# EAGLE design full_commissioning_shield (EAGLE 7.3.0)

## Sheet 1 of 11: arduino footprint
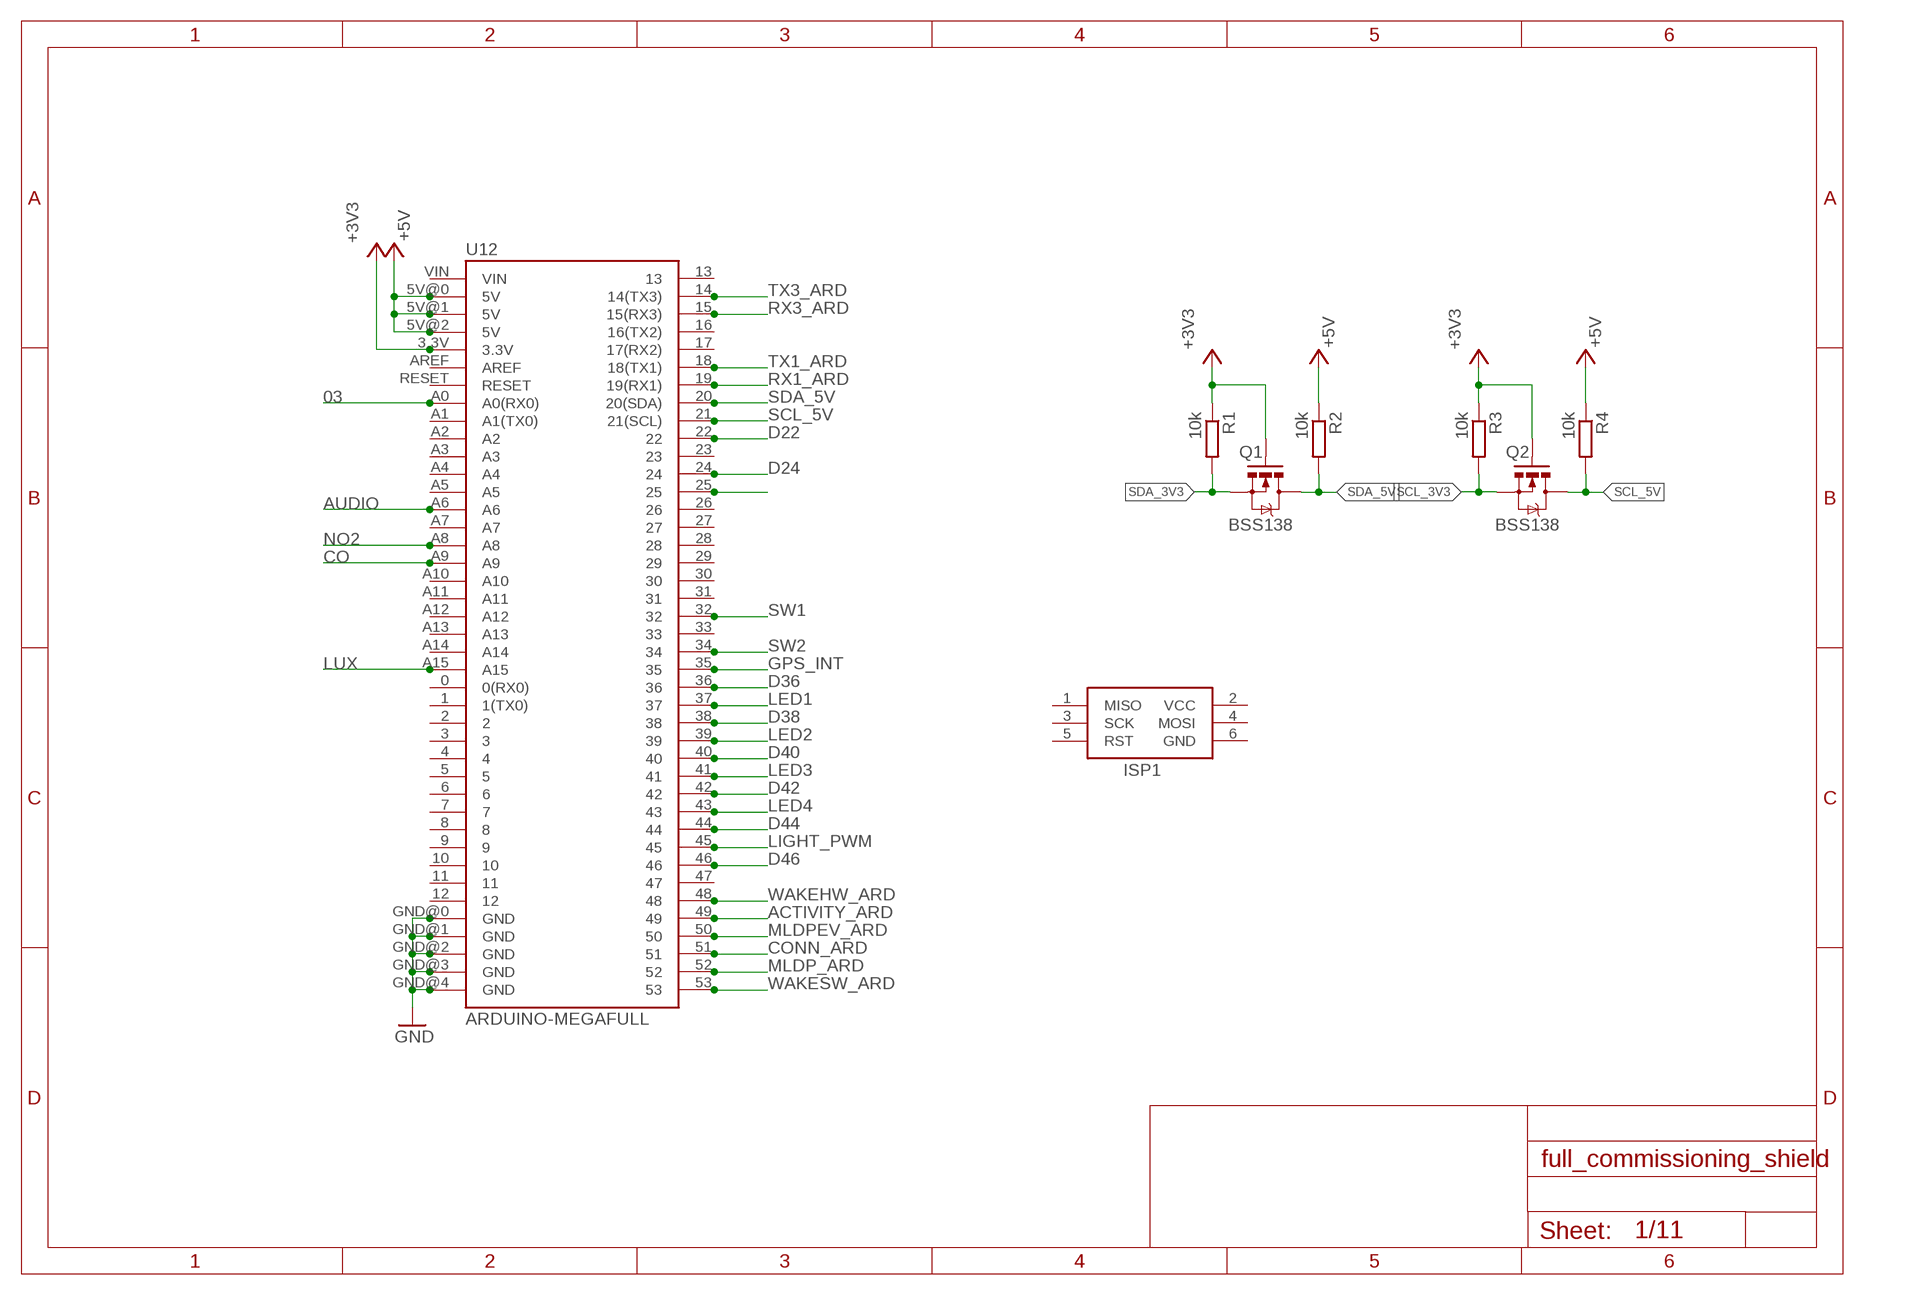
[diagram p0: schematic, sheet 1]

### Parts
ISP1  AVRISP-6  [AVRISP]
Q1  BSS138  MOSFET-NCHANNELSMD  [SOT23-3]
Q2  BSS138  MOSFET-NCHANNELSMD  [SOT23-3]
R1  10k  R-EU_R0805  [R0805]
R2  10k  R-EU_R0805  [R0805]
R3  10k  R-EU_R0805  [R0805]
R4  10k  R-EU_R0805  [R0805]
U12  ARDUINO-MEGAFULL  [ARDUINO_MEGA]

### Nets
03: U12.A0(A0(RX0)) ; also sheet 6
+3V3: Q1.1(G) Q2.1(G) R1.1 R3.1 U12.3.3V ; also sheet 3,4,6,7,10,11
+5V: R2.1 R4.1 U12.5V@0(5V) U12.5V@1(5V) U12.5V@2(5V) ; also sheet 2,3,6,9,10
ACTIVITY_ARD: U12.49 ; also sheet 3
AUDIO: U12.A6 ; also sheet 10
CO: U12.A9 ; also sheet 6
CONN_ARD: U12.51 ; also sheet 3
D22: U12.22
D24: U12.24
D36: U12.36 ; also sheet 5
D38: U12.38 ; also sheet 5
D40: U12.40 ; also sheet 5
D42: U12.42 ; also sheet 5
D44: U12.44 ; also sheet 5
D46: U12.46 ; also sheet 5
GND: U12.GND@0(GND) U12.GND@1(GND) U12.GND@2(GND) U12.GND@3(GND) U12.GND@4(GND) ; also sheet 2,3,4,5,6,7,8,9,10,11
GPS_INT: U12.35 ; also sheet 11
LED1: U12.37 ; also sheet 5
LED2: U12.39 ; also sheet 5
LED3: U12.41 ; also sheet 5
LED4: U12.43 ; also sheet 5
LIGHT_PWM: U12.45 ; also sheet 8
LUX: U12.A15 ; also sheet 6
MLDP_ARD: U12.52 ; also sheet 3
MLDPEV_ARD: U12.50 ; also sheet 3
N$33: U12.25
NO2: U12.A8 ; also sheet 6
RX1_ARD: U12.19(19(RX1))
RX3_ARD: U12.15(15(RX3)) ; also sheet 3
SCL_3V3: Q2.2(S) R3.2 ; also sheet 4,6,7,11
SCL_5V: Q2.3(D) R4.2 U12.21(21(SCL)) ; also sheet 9
SDA_3V3: Q1.2(S) R1.2 ; also sheet 4,6,7,11
SDA_5V: Q1.3(D) R2.2 U12.20(20(SDA)) ; also sheet 9
SW1: U12.32 ; also sheet 5
SW2: U12.34 ; also sheet 5
TX1_ARD: U12.18(18(TX1))
TX3_ARD: U12.14(14(TX3)) ; also sheet 3
WAKEHW_ARD: U12.48 ; also sheet 3
WAKESW_ARD: U12.53 ; also sheet 3
Unconnected: ISP1.1(MISO) ISP1.3(SCK) ISP1.4(MOSI) ISP1.5(RST) U12.0(0(RX0)) U12.1(1(TX0)) U12.2 U12.3 U12.4 U12.5 U12.6 U12.7 U12.8 U12.9 U12.10 U12.11 U12.12 U12.13 U12.16(16(TX2)) U12.17(17(RX2)) U12.23 U12.26 U12.27 U12.28 U12.29 U12.30 U12.31 U12.33 U12.47 U12.A1(A1(TX0)) U12.A2 U12.A3 U12.A4 U12.A5 U12.A7 U12.A10 U12.A11 U12.A12 U12.A13 U12.A14 U12.AREF U12.RESET U12.VIN

## Sheet 2 of 11: Power supply
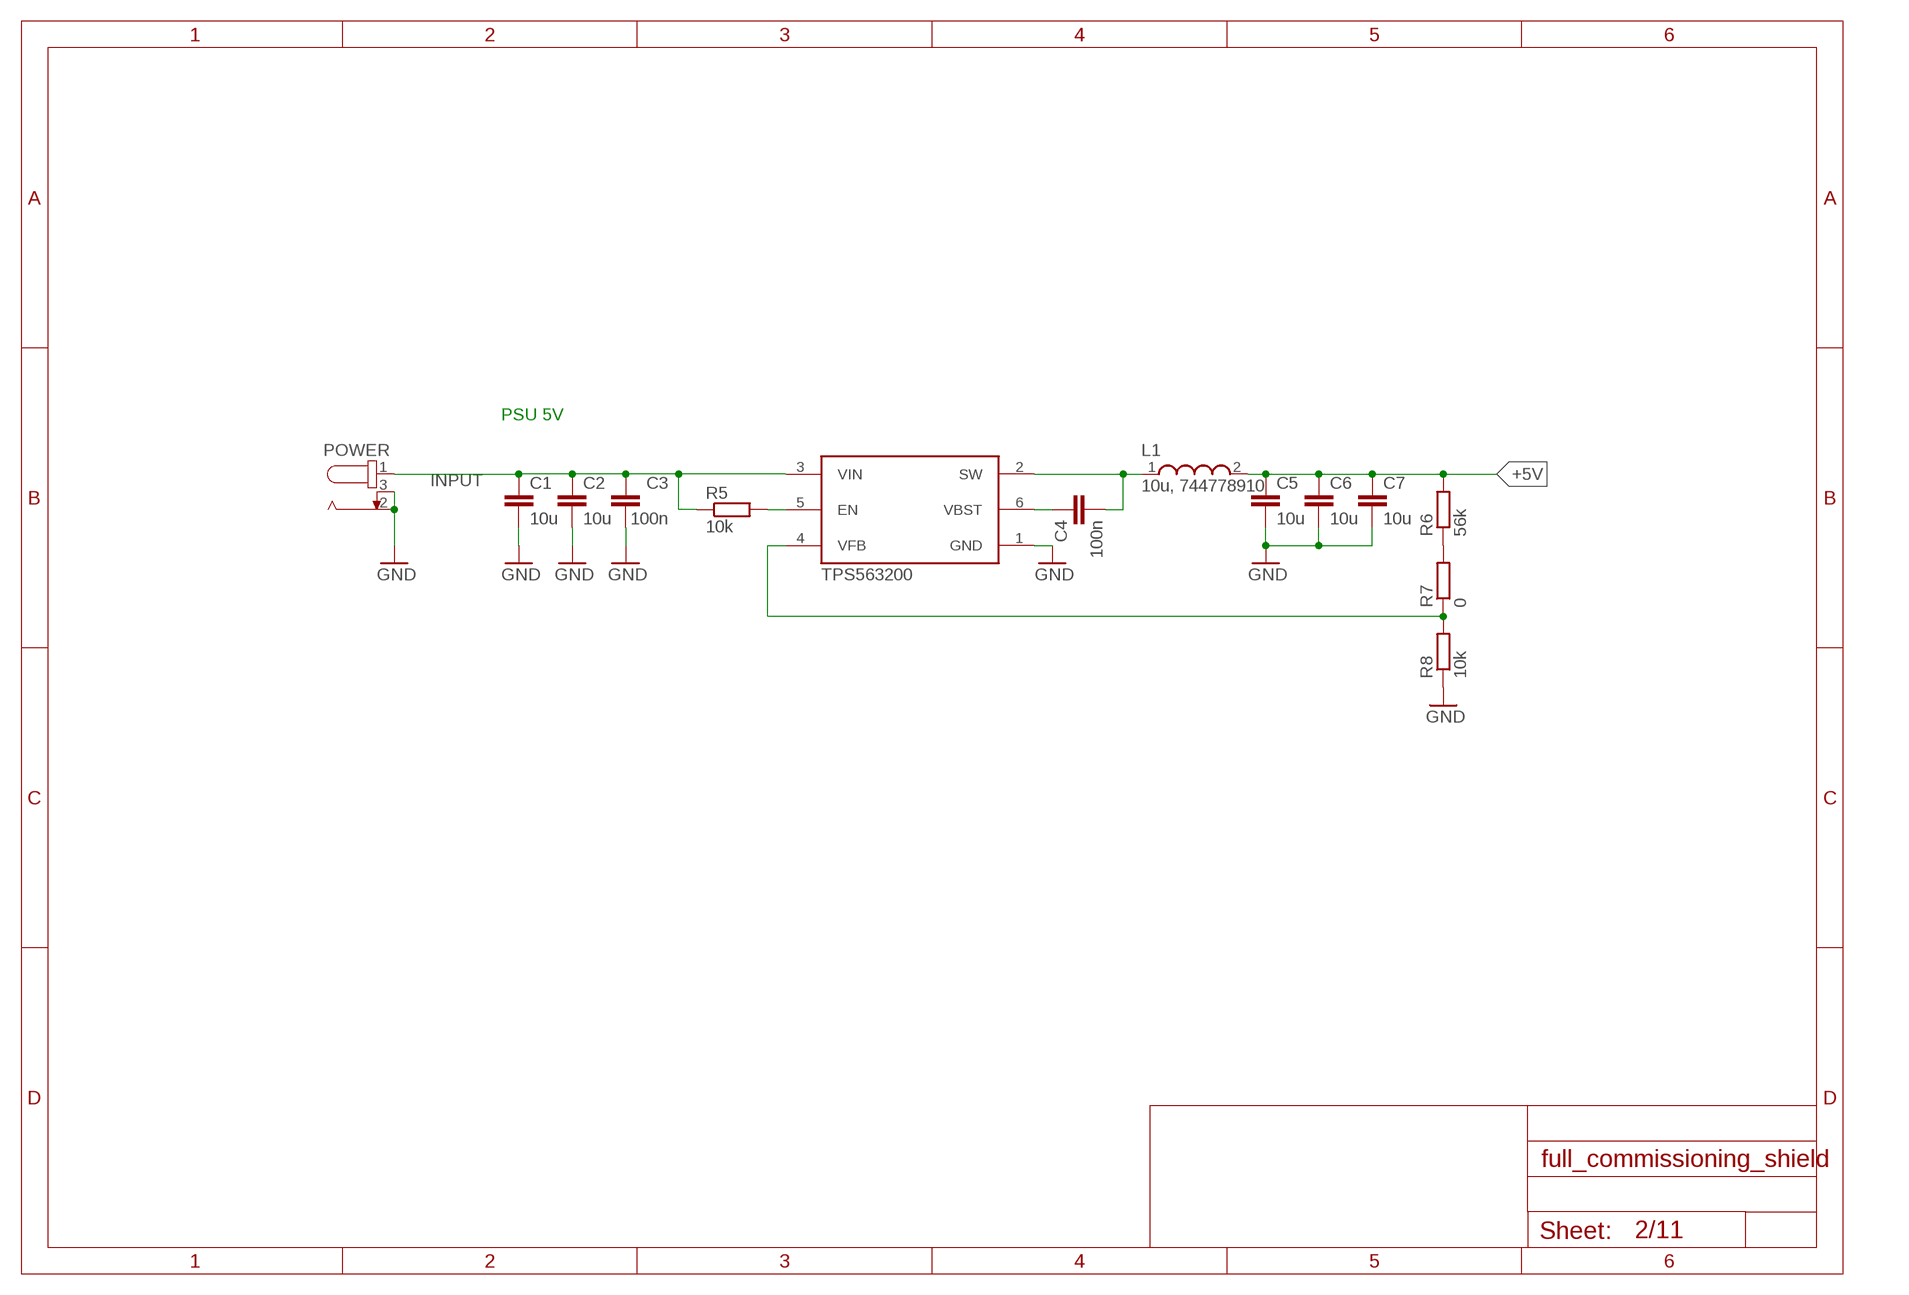
[diagram p1: schematic, sheet 2]

### Parts
C1  10u  C-EUC1206  [C1206]
C2  10u  C-EUC1206  [C1206]
C3  100n  C-EUC0805  [C0805]
C4  100n  C-EUC0805  [C0805]
C5  10u  C-EUC1206  [C1206]
C6  10u  C-EUC1206  [C1206]
C7  10u  C-EUC1206  [C1206]
L1  10u, 744778910  WE-PD_7332/7345  [WE-PD_7332/7345]
POWER  694108301002  [69410X301002]
R5  10k  R-EU_R0805  [R0805]
R6  56k  R-EU_R0805  [R0805]
R7  0  R-EU_R0805  [R0805]
R8  10k  R-EU_R0805  [R0805]
U13  TPS563200  [SOT95P280X145-6N]

### Nets
+5V: C5.1 C6.1 C7.1 L1.2 R6.2 ; also sheet 1,3,6,9,10
GND: C1.2 C2.2 C3.1 C5.2 C6.2 C7.2 POWER.2 POWER.3 R8.1 U13.1(GND) ; also sheet 1,3,4,5,6,7,8,9,10,11
INPUT: C1.1 C2.1 C3.2 POWER.1 R5.1 U13.3(VIN) ; also sheet 8
N$3: R5.2 U13.5(EN)
N$4: C4.1 U13.6(VBST)
N$5: R6.1 R7.2
N$6: R7.1 R8.2 U13.4(VFB)
SW: C4.2 L1.1 U13.2(SW)

### Notes on the sheet
- PSU 5V
- TPS563200

## Sheet 3 of 11: BLE
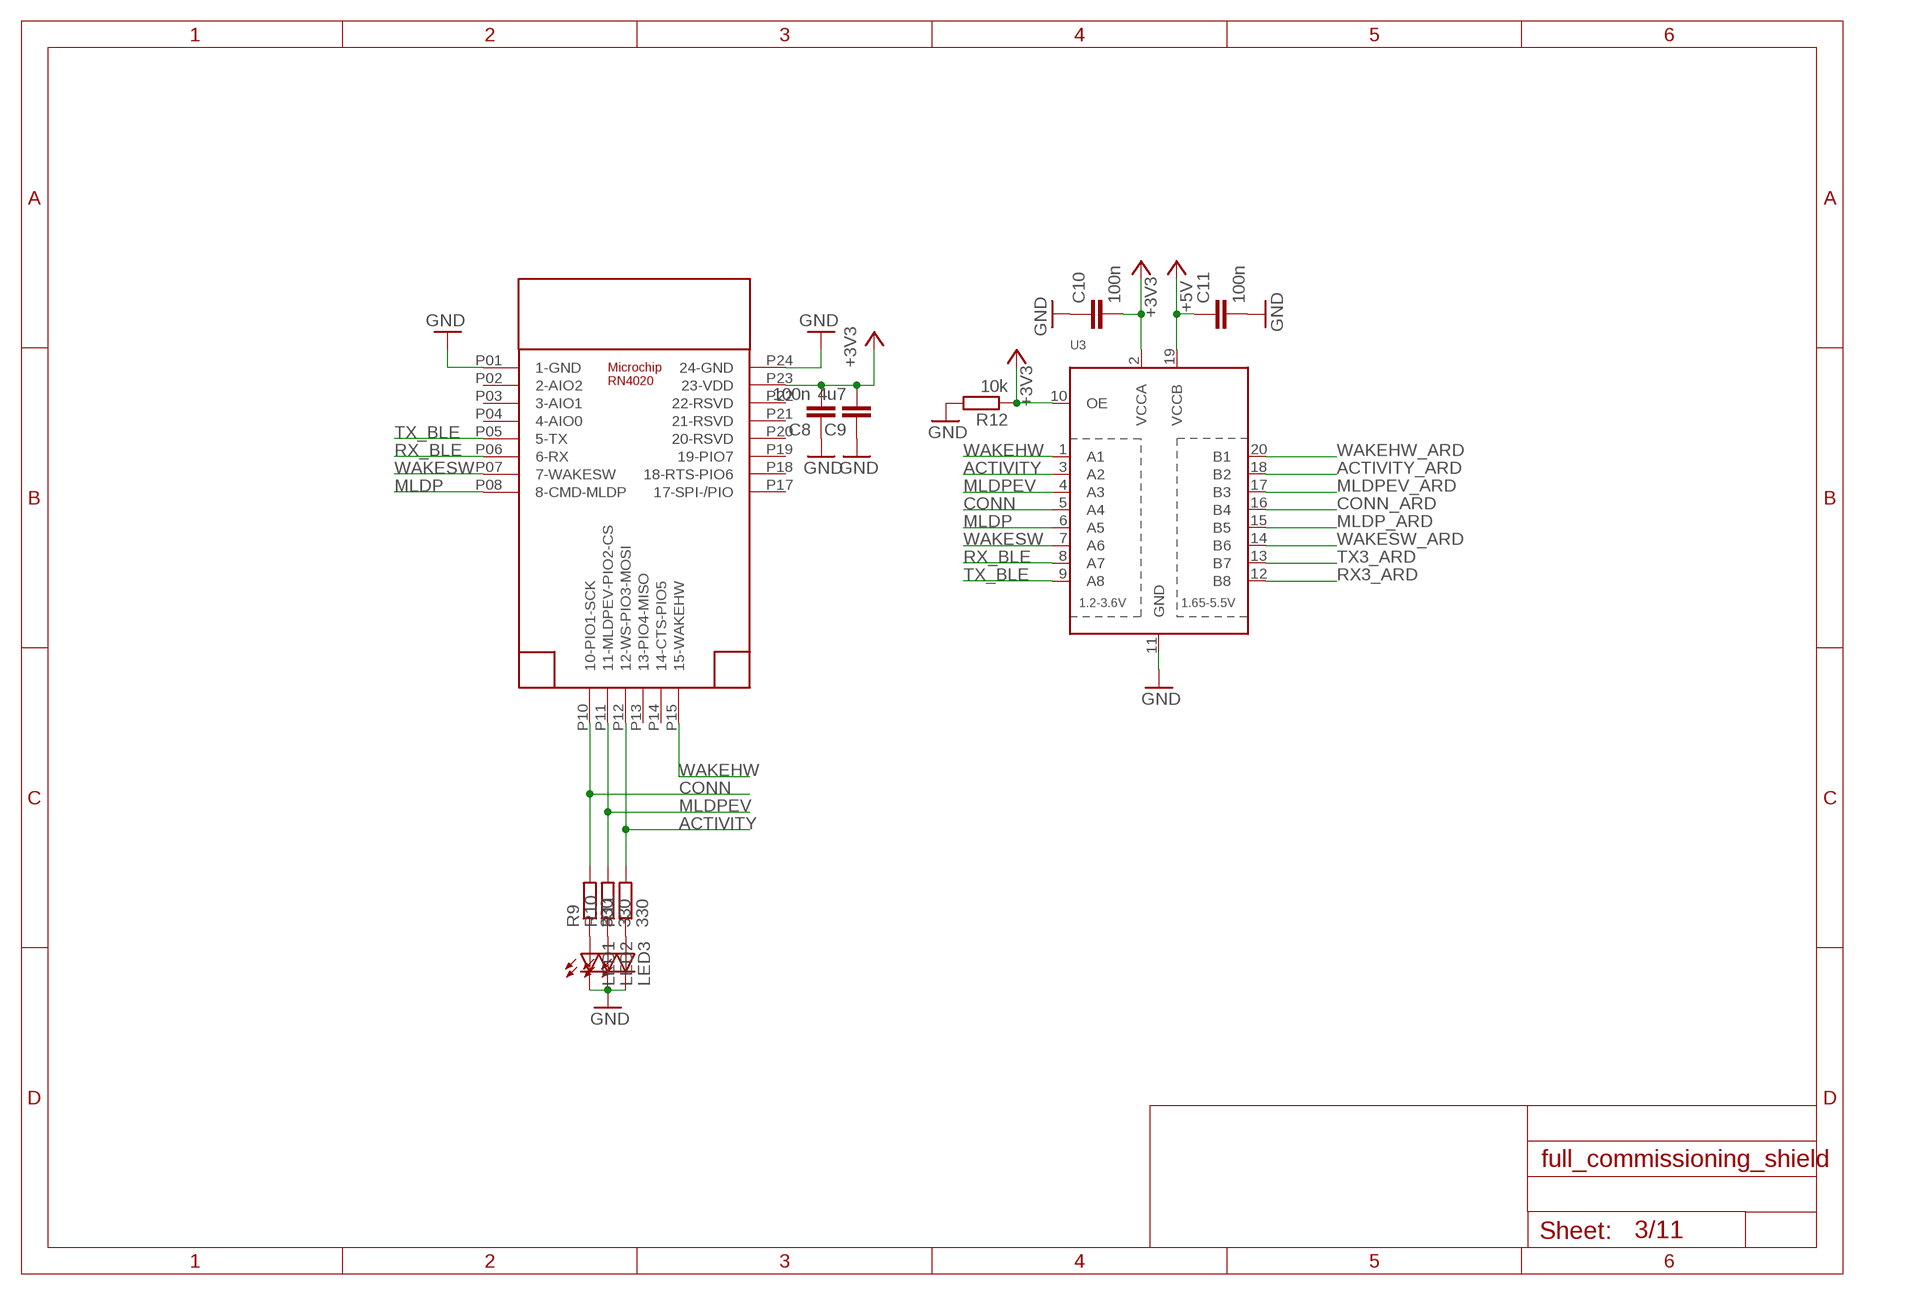
[diagram p2: schematic, sheet 3]

### Parts
C8  100n  C-EUC0805K  [C0805K]
C9  4u7  C-EUC0805K  [C0805K]
C10  100n  C-EUC0805  [C0805]
C11  100n  C-EUC0805  [C0805]
LED1  LEDCHIP-LED0805  [CHIP-LED0805]
LED2  LEDCHIP-LED0805  [CHIP-LED0805]
LED3  LEDCHIP-LED0805  [CHIP-LED0805]
R9  330  R-EU_R0805  [R0805]
R10  330  R-EU_R0805  [R0805]
R11  330  R-EU_R0805  [R0805]
R12  10k  R-EU_R0805  [R0805]
U2  RN4020  [RN4020SMD]
U3  TXB0108PWR  [TSSOP20]

### Nets
+3V3: C8.2 C9.2 C10.2 R12.1 U2.P23(23-VDD) U3.2(VCCA) U3.10(OE) ; also sheet 1,4,6,7,10,11
+5V: C11.1 U3.19(VCCB) ; also sheet 1,2,6,9,10
ACTIVITY: R11.2 U2.P12(12-WS-PIO3-MOSI) U3.3(A2)
ACTIVITY_ARD: U3.18(B2) ; also sheet 1
CONN: R9.2 U2.P10(10-PIO1-SCK) U3.5(A4)
CONN_ARD: U3.16(B4) ; also sheet 1
GND: C8.1 C9.1 C10.1 C11.2 LED1.C LED2.C LED3.C R12.2 U2.P01(1-GND) U2.P24(24-GND) U3.11(GND) ; also sheet 1,2,4,5,6,7,8,9,10,11
MLDP: U2.P08(8-CMD-MLDP) U3.6(A5)
MLDP_ARD: U3.15(B5) ; also sheet 1
MLDPEV: R10.2 U2.P11(11-MLDPEV-PIO2-CS) U3.4(A3)
MLDPEV_ARD: U3.17(B3) ; also sheet 1
N$16: LED1.A R9.1
N$17: LED2.A R10.1
N$18: LED3.A R11.1
RX3_ARD: U3.12(B8) ; also sheet 1
RX_BLE: U2.P06(6-RX) U3.8(A7)
TX3_ARD: U3.13(B7) ; also sheet 1
TX_BLE: U2.P05(5-TX) U3.9(A8)
WAKEHW: U2.P15(15-WAKEHW) U3.1(A1)
WAKEHW_ARD: U3.20(B1) ; also sheet 1
WAKESW: U2.P07(7-WAKESW) U3.7(A6)
WAKESW_ARD: U3.14(B6) ; also sheet 1
Unconnected: U2.P02(2-AIO2) U2.P03(3-AIO1) U2.P04(4-AIO0) U2.P13(13-PIO4-MISO) U2.P14(14-CTS-PIO5) U2.P17(17-SPI-/PIO) U2.P18(18-RTS-PIO6) U2.P19(19-PIO7) U2.P20(20-RSVD) U2.P21(21-RSVD) U2.P22(22-RSVD)

## Sheet 4 of 11: NFC
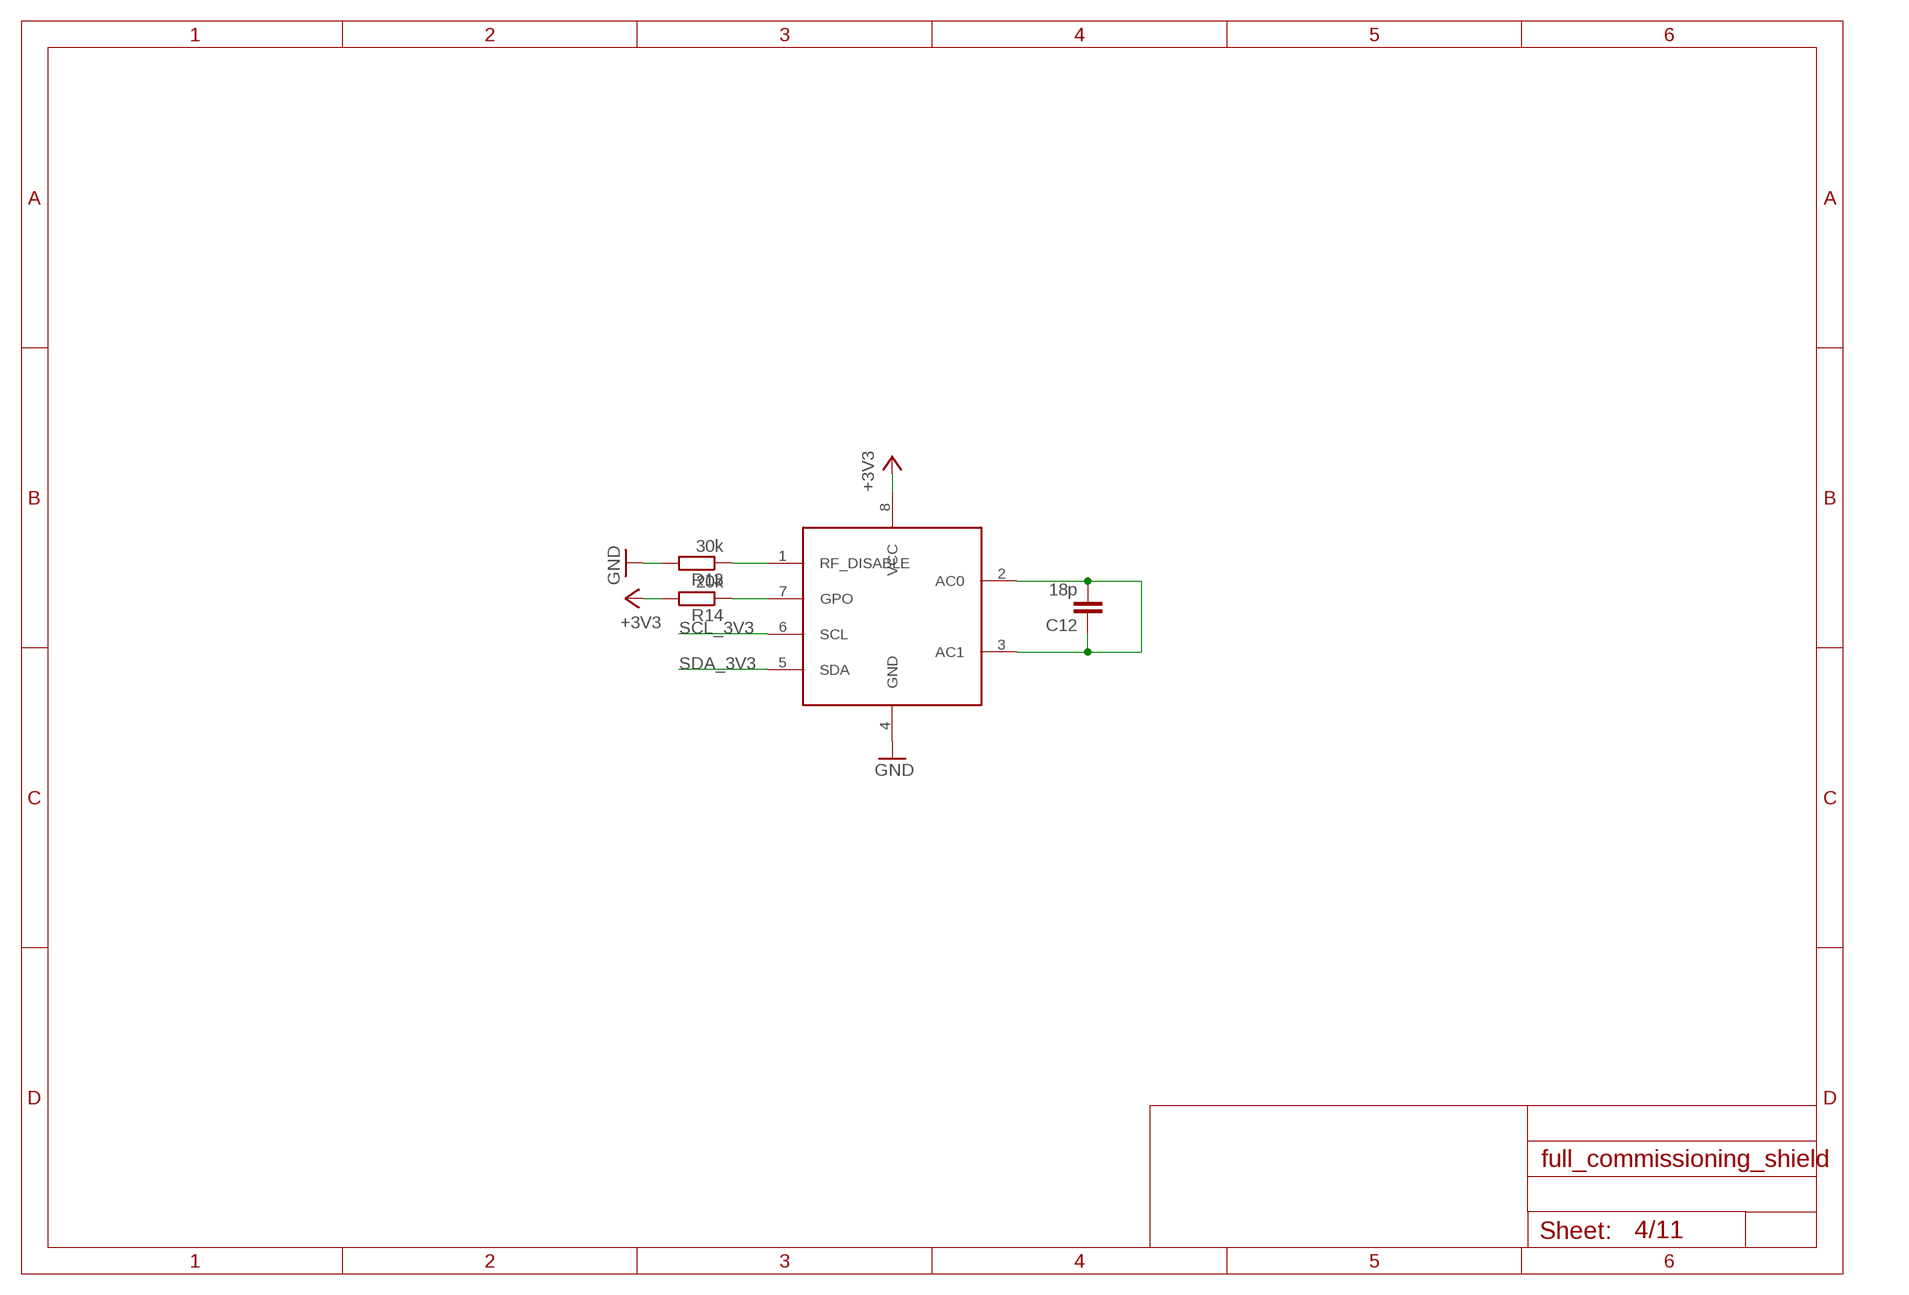
[diagram p3: schematic, sheet 4]

### Parts
C12  18p  C-EUC0805K  [C0805K]
NFC  M24SR  [SO8]
R13  30k  R-EU_R0805  [R0805]
R14  20k  R-EU_R0805  [R0805]

### Nets
+3V3: NFC.8(VCC) R14.2 ; also sheet 1,3,6,7,10,11
GND: NFC.4(GND) R13.2 ; also sheet 1,2,3,5,6,7,8,9,10,11
N$9: C12.1 C12.2 NFC.2(AC0) NFC.3(AC1)
N$11: NFC.1(RF_DISABLE) R13.1
N$12: NFC.7(GPO) R14.1
SCL_3V3: NFC.6(SCL) ; also sheet 1,6,7,11
SDA_3V3: NFC.5(SDA) ; also sheet 1,6,7,11

## Sheet 5 of 11: Leds & switches
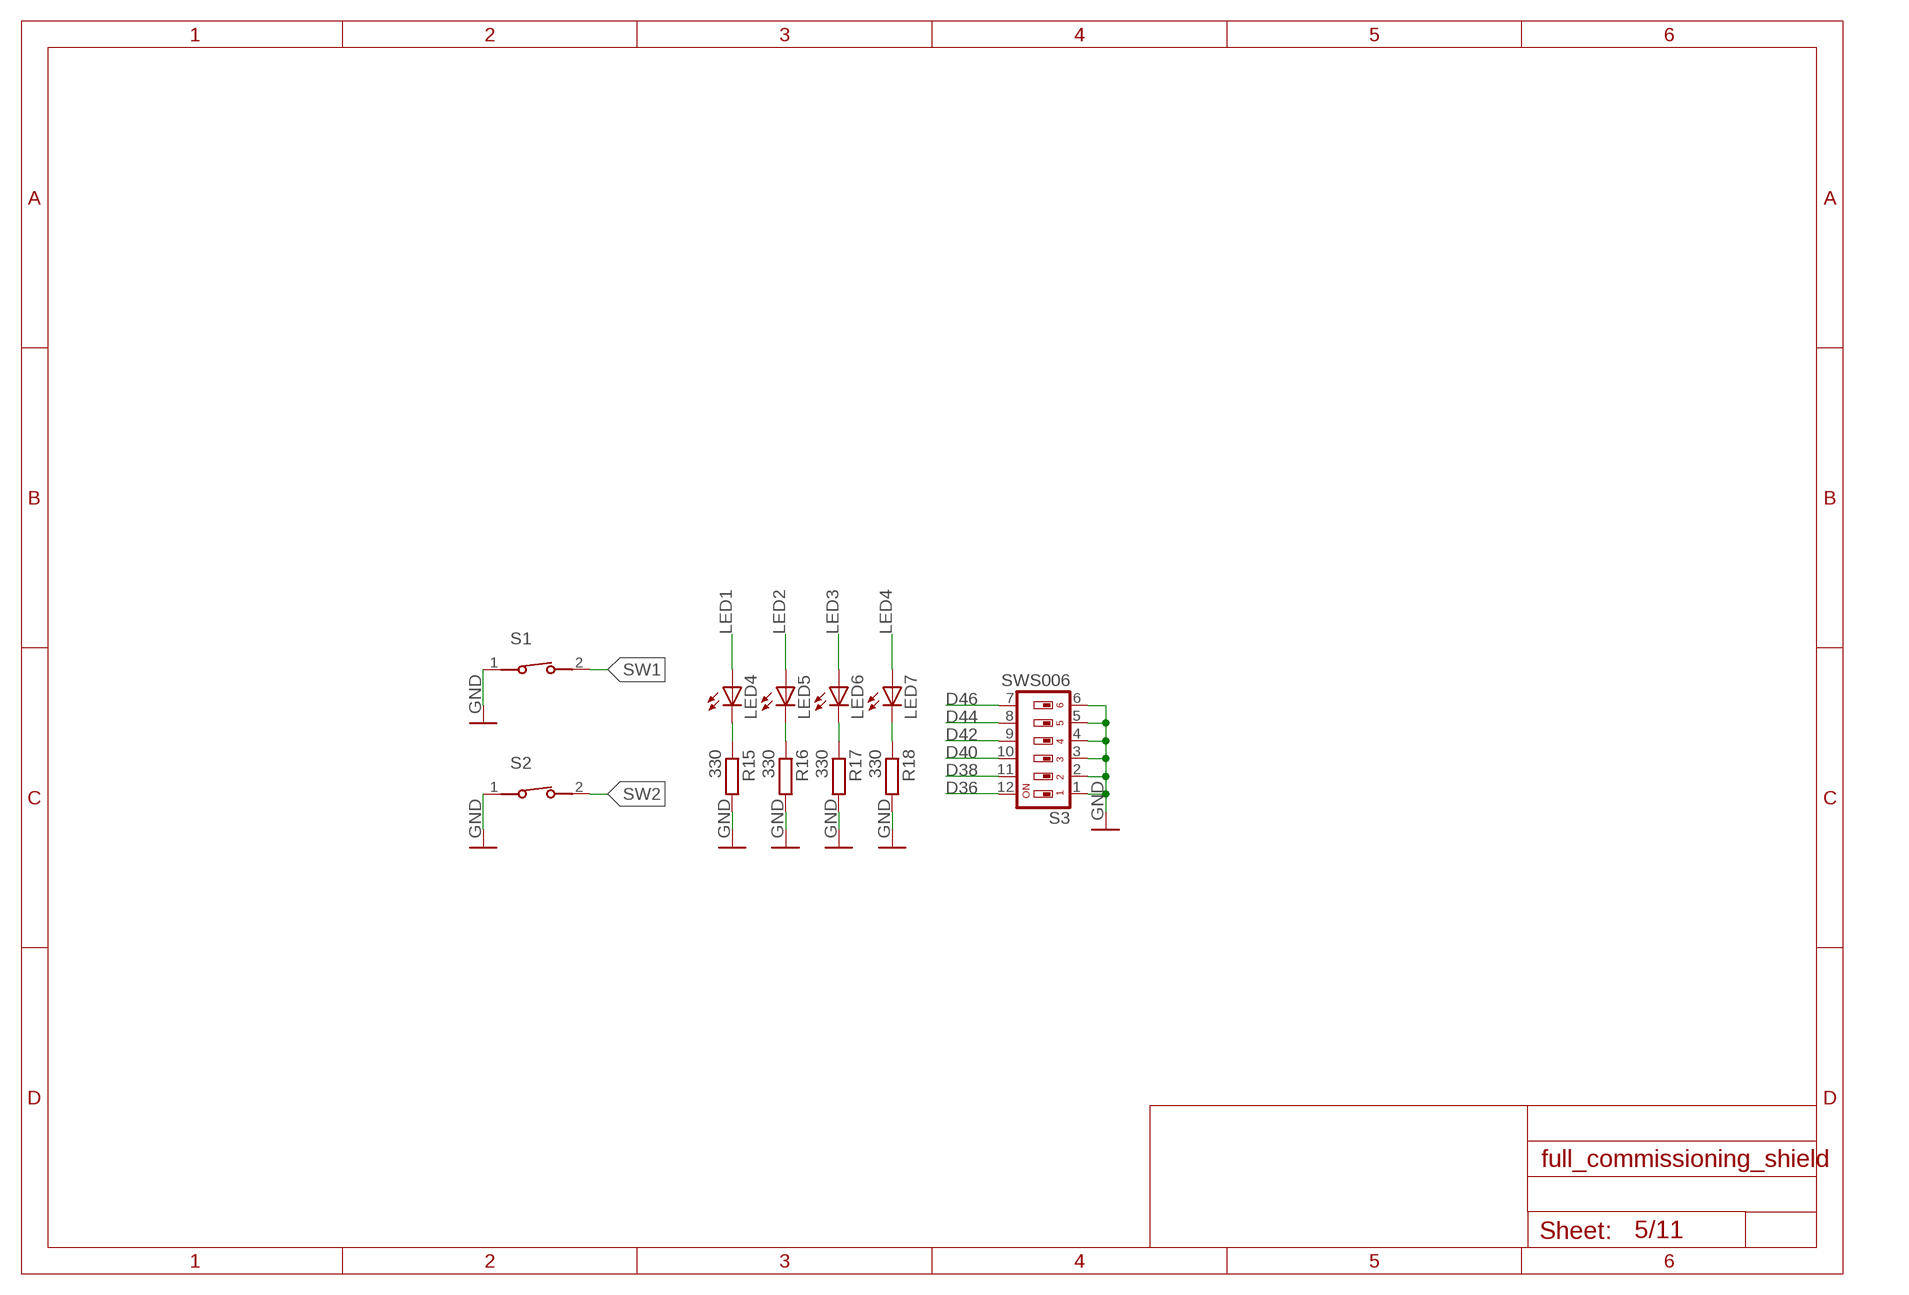
[diagram p4: schematic, sheet 5]

### Parts
LED4  LEDCHIP-LED0805  [CHIP-LED0805]
LED5  LEDCHIP-LED0805  [CHIP-LED0805]
LED6  LEDCHIP-LED0805  [CHIP-LED0805]
LED7  LEDCHIP-LED0805  [CHIP-LED0805]
R15  330  R-EU_R0805  [R0805]
R16  330  R-EU_R0805  [R0805]
R17  330  R-EU_R0805  [R0805]
R18  330  R-EU_R0805  [R0805]
S1  434111043826  [434111043826]
S2  434111043826  [434111043826]
S3  SWS006  [SMS-006]

### Nets
D36: S3.12 ; also sheet 1
D38: S3.11 ; also sheet 1
D40: S3.10 ; also sheet 1
D42: S3.9 ; also sheet 1
D44: S3.8 ; also sheet 1
D46: S3.7 ; also sheet 1
GND: R15.2 R16.2 R17.2 R18.2 S1.1 S2.1 S3.1 S3.2 S3.3 S3.4 S3.5 S3.6 ; also sheet 1,2,3,4,6,7,8,9,10,11
LED1: LED4.A ; also sheet 1
LED2: LED5.A ; also sheet 1
LED3: LED6.A ; also sheet 1
LED4: LED7.A ; also sheet 1
N$1: LED5.C R16.1
N$2: LED4.C R15.1
N$8: LED6.C R17.1
N$21: LED7.C R18.1
SW1: S1.2 ; also sheet 1
SW2: S2.2 ; also sheet 1

## Sheet 6 of 11: Sensors gas + lux + temp
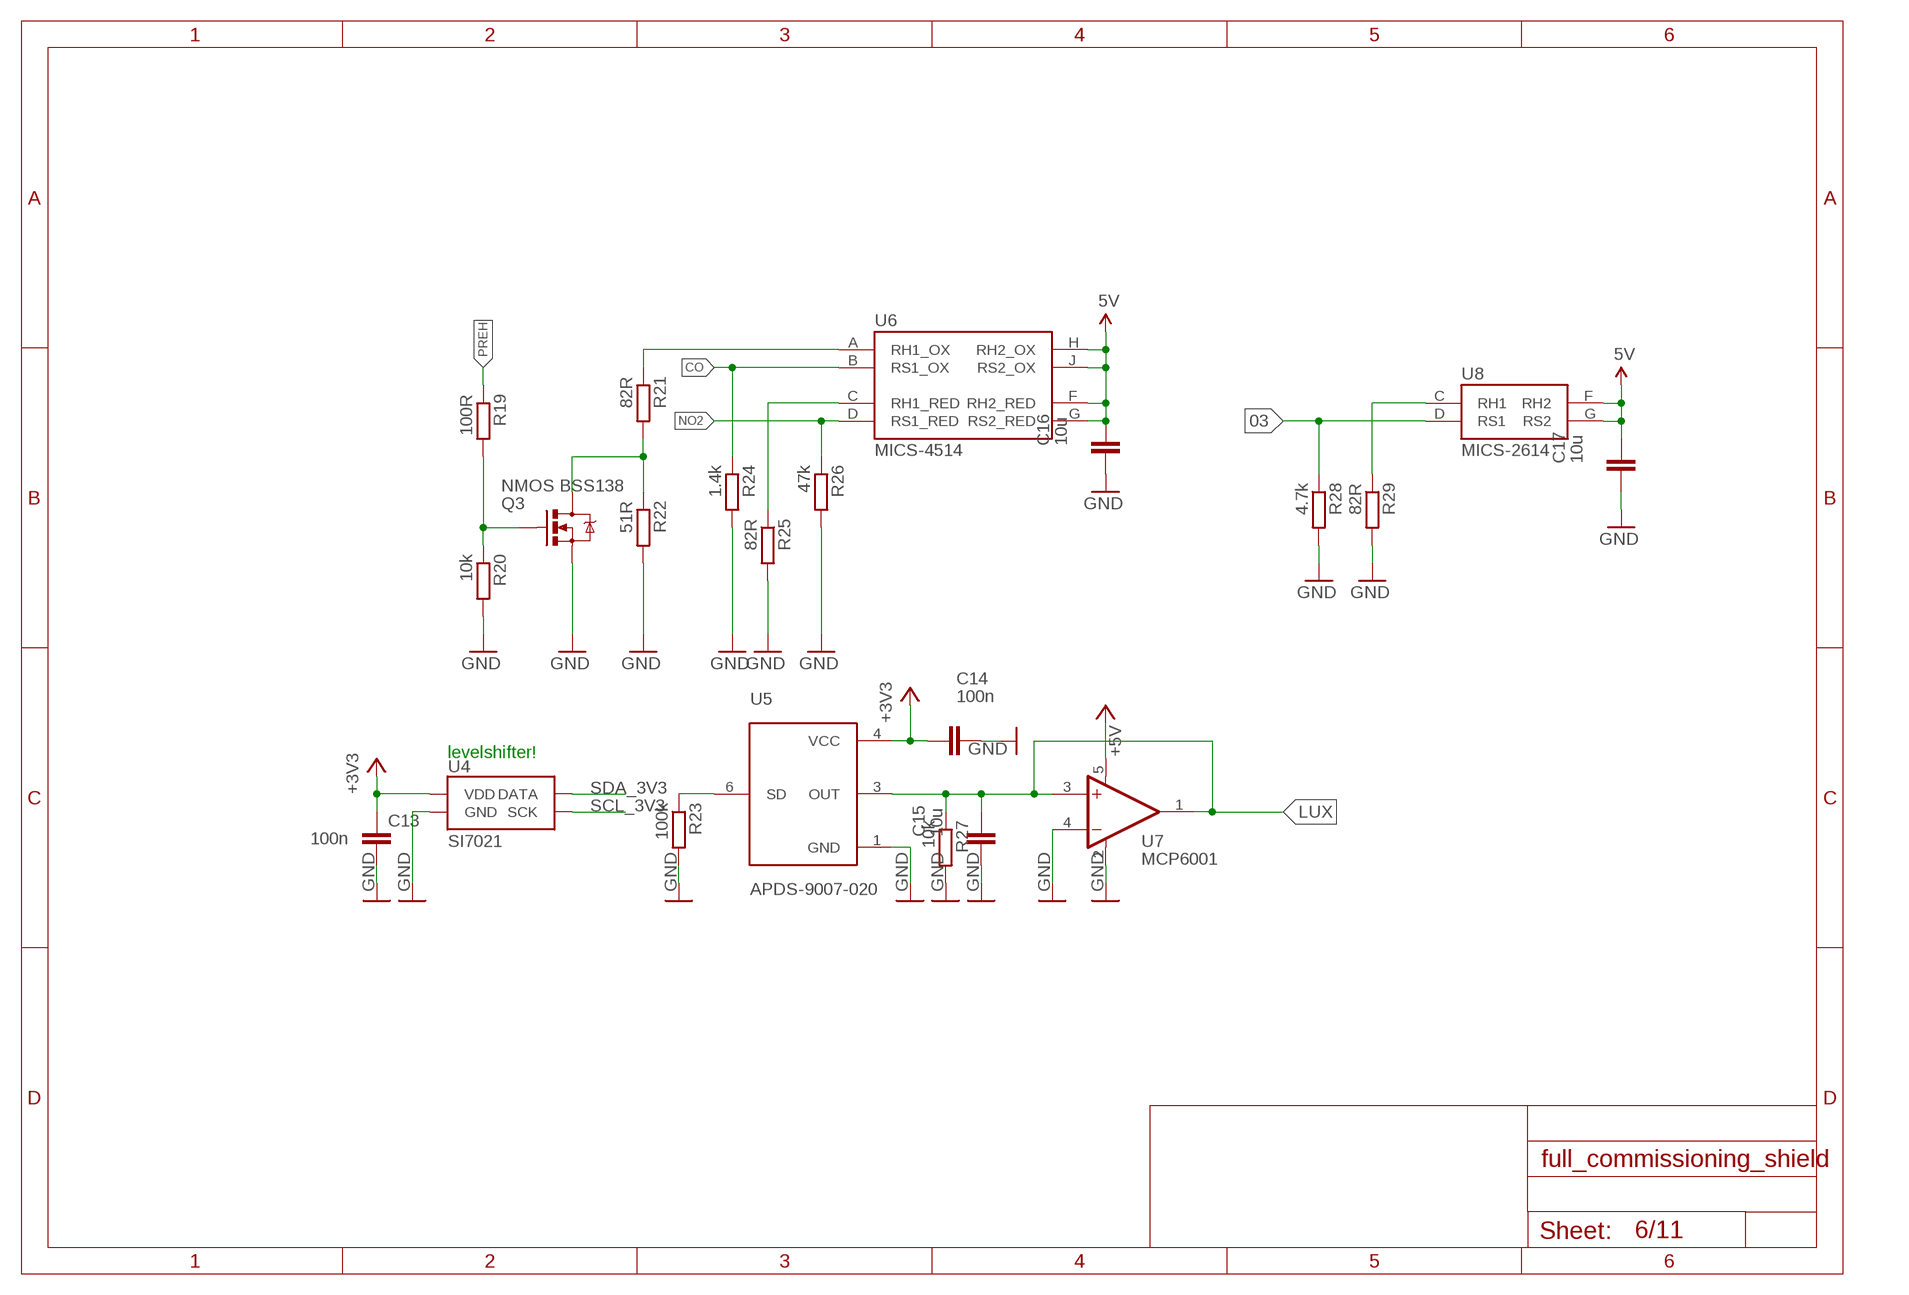
[diagram p5: schematic, sheet 6]

### Parts
C13  100n  C-EUC0805  [C0805]
C14  100n  C-EUC0805  [C0805]
C15  10u  C-EUC0805  [C0805]
C16  10u  C-EUC0805  [C0805]
C17  10u  C-EUC0805  [C0805]
Q3  NMOS BSS138  MOSFET-NCHANNELSMD  [SOT23-3]
R19  100R  R-EU_R0805  [R0805]
R20  10k  R-EU_R0805  [R0805]
R21  82R  R-EU_R0805  [R0805]
R22  51R  R-EU_R0805  [R0805]
R23  100k  R-EU_R0805  [R0805]
R24  1.4k  R-EU_R0805  [R0805]
R25  82R  R-EU_R0805  [R0805]
R26  47k  R-EU_R0805  [R0805]
R27  10k  R-EU_R0805  [R0805]
R28  4.7k  R-EU_R0805  [R0805]
R29  82R  R-EU_R0805  [R0805]
U4  SI7021  [SI7021]
U5  APDS-9007-020  [LCC140P200X240X80-6]
U6  MICS-4514  [MICS_10-SMD]
U7  MCP6001  [SOT23-5]
U8  MICS-2614  [MICS_10-SMD]

### Nets
03: R28.1 U8.D(RS1) ; also sheet 1
+3V3: C13.2 C14.2 U4.VDD U5.4(VCC) ; also sheet 1,3,4,7,10,11
+5V: C16.1 C17.1 U6.F(RH2_RED) U6.G(RS2_RED) U6.H(RH2_OX) U6.J(RS2_OX) U7.5(V+) U8.F(RH2) U8.G(RS2) ; supply symbol labelled 5V ; also sheet 1,2,3,9,10
CO: R24.1 U6.B(RS1_OX) ; also sheet 1
GND: C13.1 C14.1 C15.2 C16.2 C17.2 Q3.2(S) R20.2 R22.2 R23.2 R24.2 R25.2 R26.2 R27.2 R28.2 R29.2 U4.GND U5.1(GND) U7.2(V-) U7.4(-IN) ; also sheet 1,2,3,4,5,7,8,9,10,11
LUX: C15.1 R27.1 U5.3(OUT) U7.1(OUT) U7.3(+IN) ; also sheet 1
N$7: R23.1 U5.6(SD)
N$10: Q3.3(D) R21.2 R22.1
N$13: Q3.1(G) R19.2 R20.1
N$14: R21.1 U6.A(RH1_OX)
N$15: R25.1 U6.C(RH1_RED)
N$22: R29.1 U8.C(RH1)
NO2: R26.1 U6.D(RS1_RED) ; also sheet 1
PREH: R19.1
SCL_3V3: U4.SCK ; also sheet 1,4,7,11
SDA_3V3: U4.DATA ; also sheet 1,4,7,11

### Notes on the sheet
- levelshifter!

## Sheet 7 of 11: Sensors compass/accelerometer + altimeter
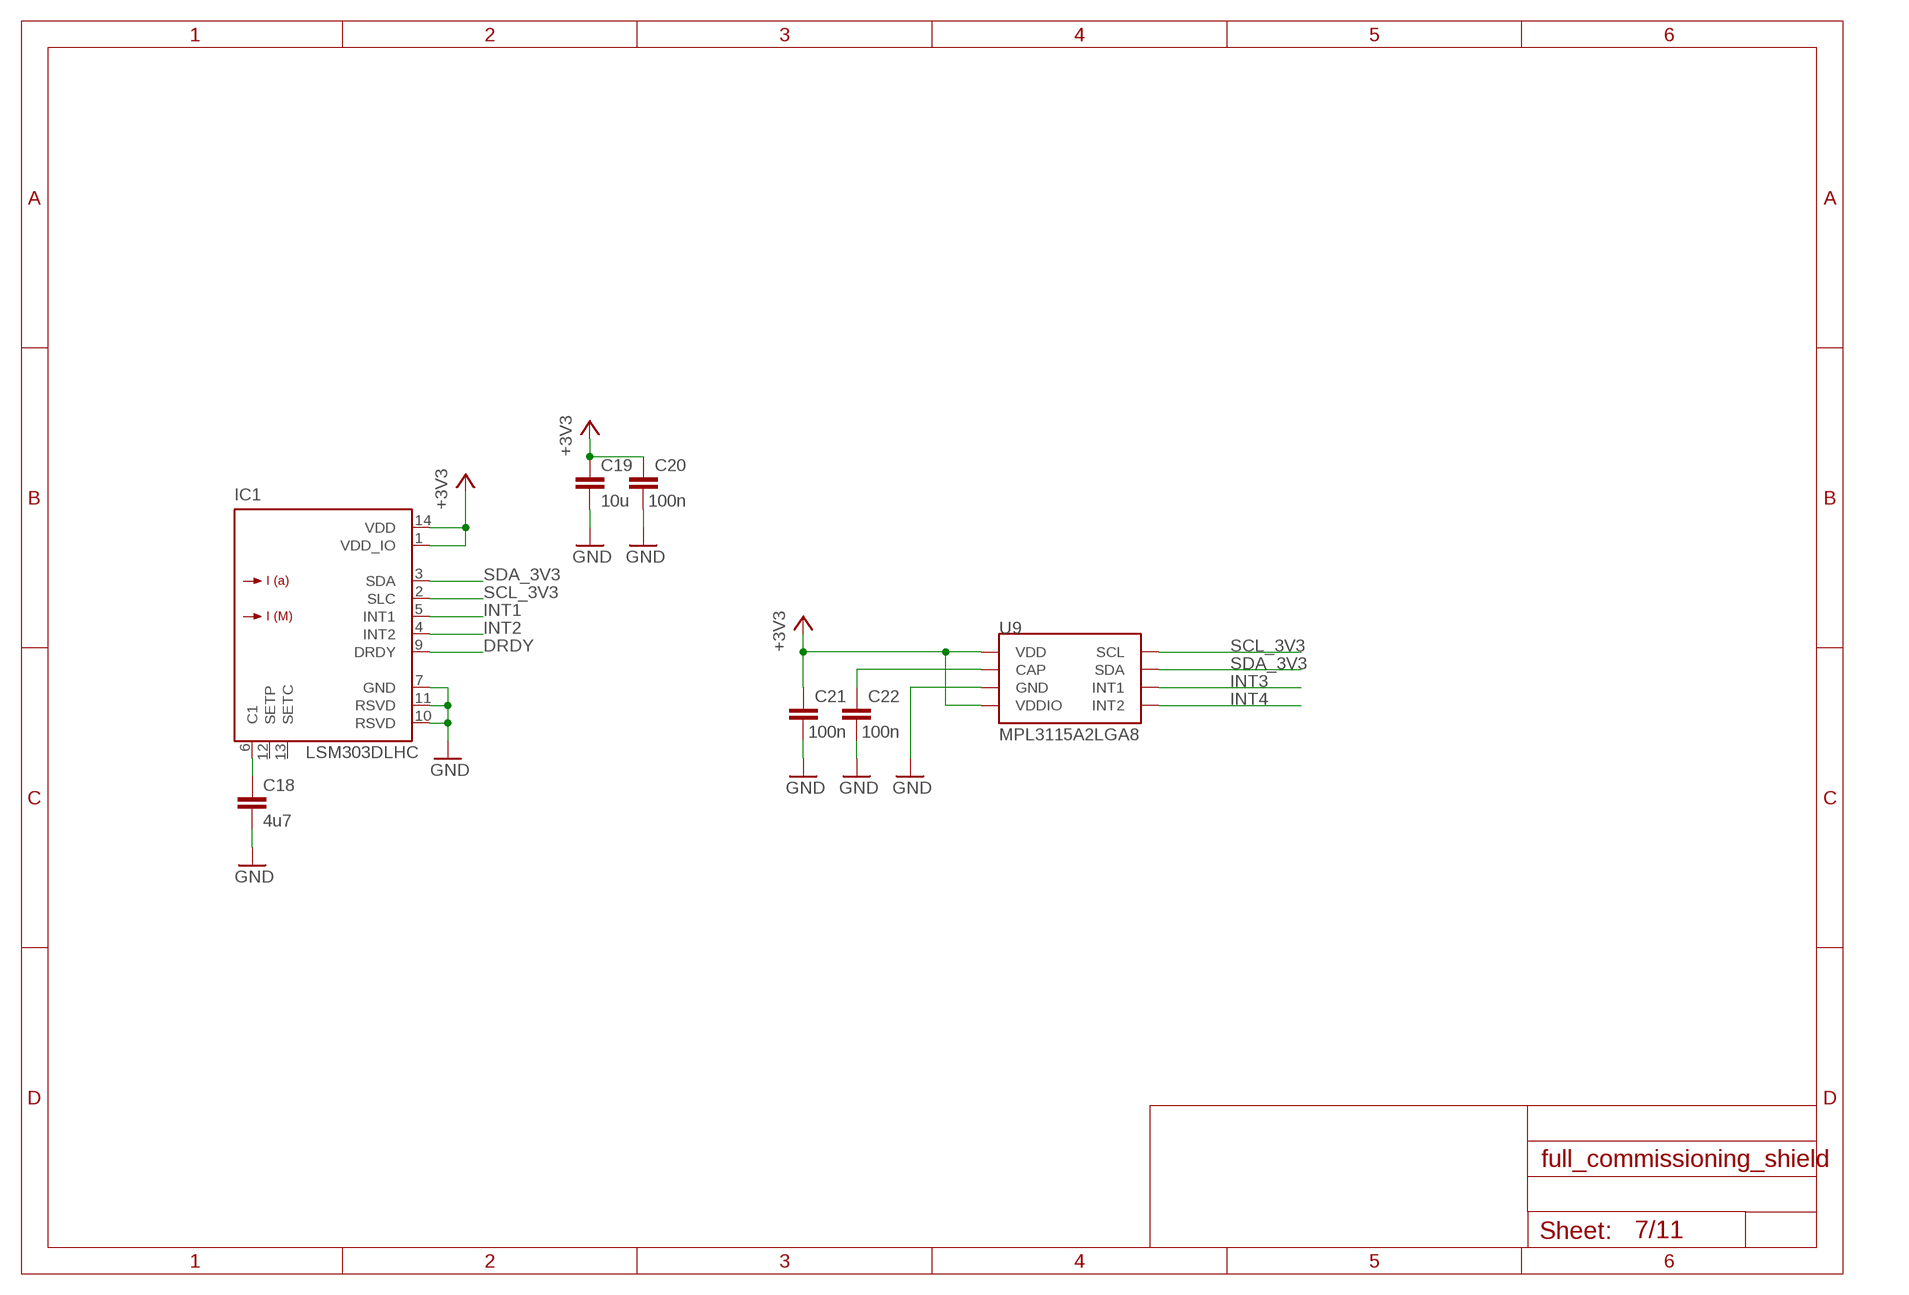
[diagram p6: schematic, sheet 7]

### Parts
C18  4u7  C-EUC0805  [C0805]
C19  10u  C-EUC0805  [C0805]
C20  100n  C-EUC0805  [C0805]
C21  100n  C-EUC0805  [C0805]
C22  100n  C-EUC0805  [C0805]
IC1  LSM303DLHC  [LGA-14]
U9  MPL3115A2LGA8  [LGA8]

### Nets
+3V3: C19.1 C20.2 C21.2 IC1.1(VDD_IO) IC1.14(VDD) U9.1(VDD) U9.4(VDDIO) ; also sheet 1,3,4,6,10,11
DRDY: IC1.9(DRDY)
GND: C18.2 C19.2 C20.1 C21.1 C22.1 IC1.7(GND) IC1.10(RSVD) IC1.11(RSVD) U9.3(GND) ; also sheet 1,2,3,4,5,6,8,9,10,11
INT1: IC1.5(INT1)
INT2: IC1.4(INT2)
INT3: U9.6(INT1)
INT4: U9.5(INT2)
N$25: C18.1 IC1.6(C1)
N$36: C22.2 U9.2(CAP)
SCL_3V3: IC1.2(SLC) U9.8(SCL) ; also sheet 1,4,6,11
SDA_3V3: IC1.3(SDA) U9.7(SDA) ; also sheet 1,4,6,11
Unconnected: IC1.12(SETP) IC1.13(SETC)

## Sheet 8 of 11: LED driver
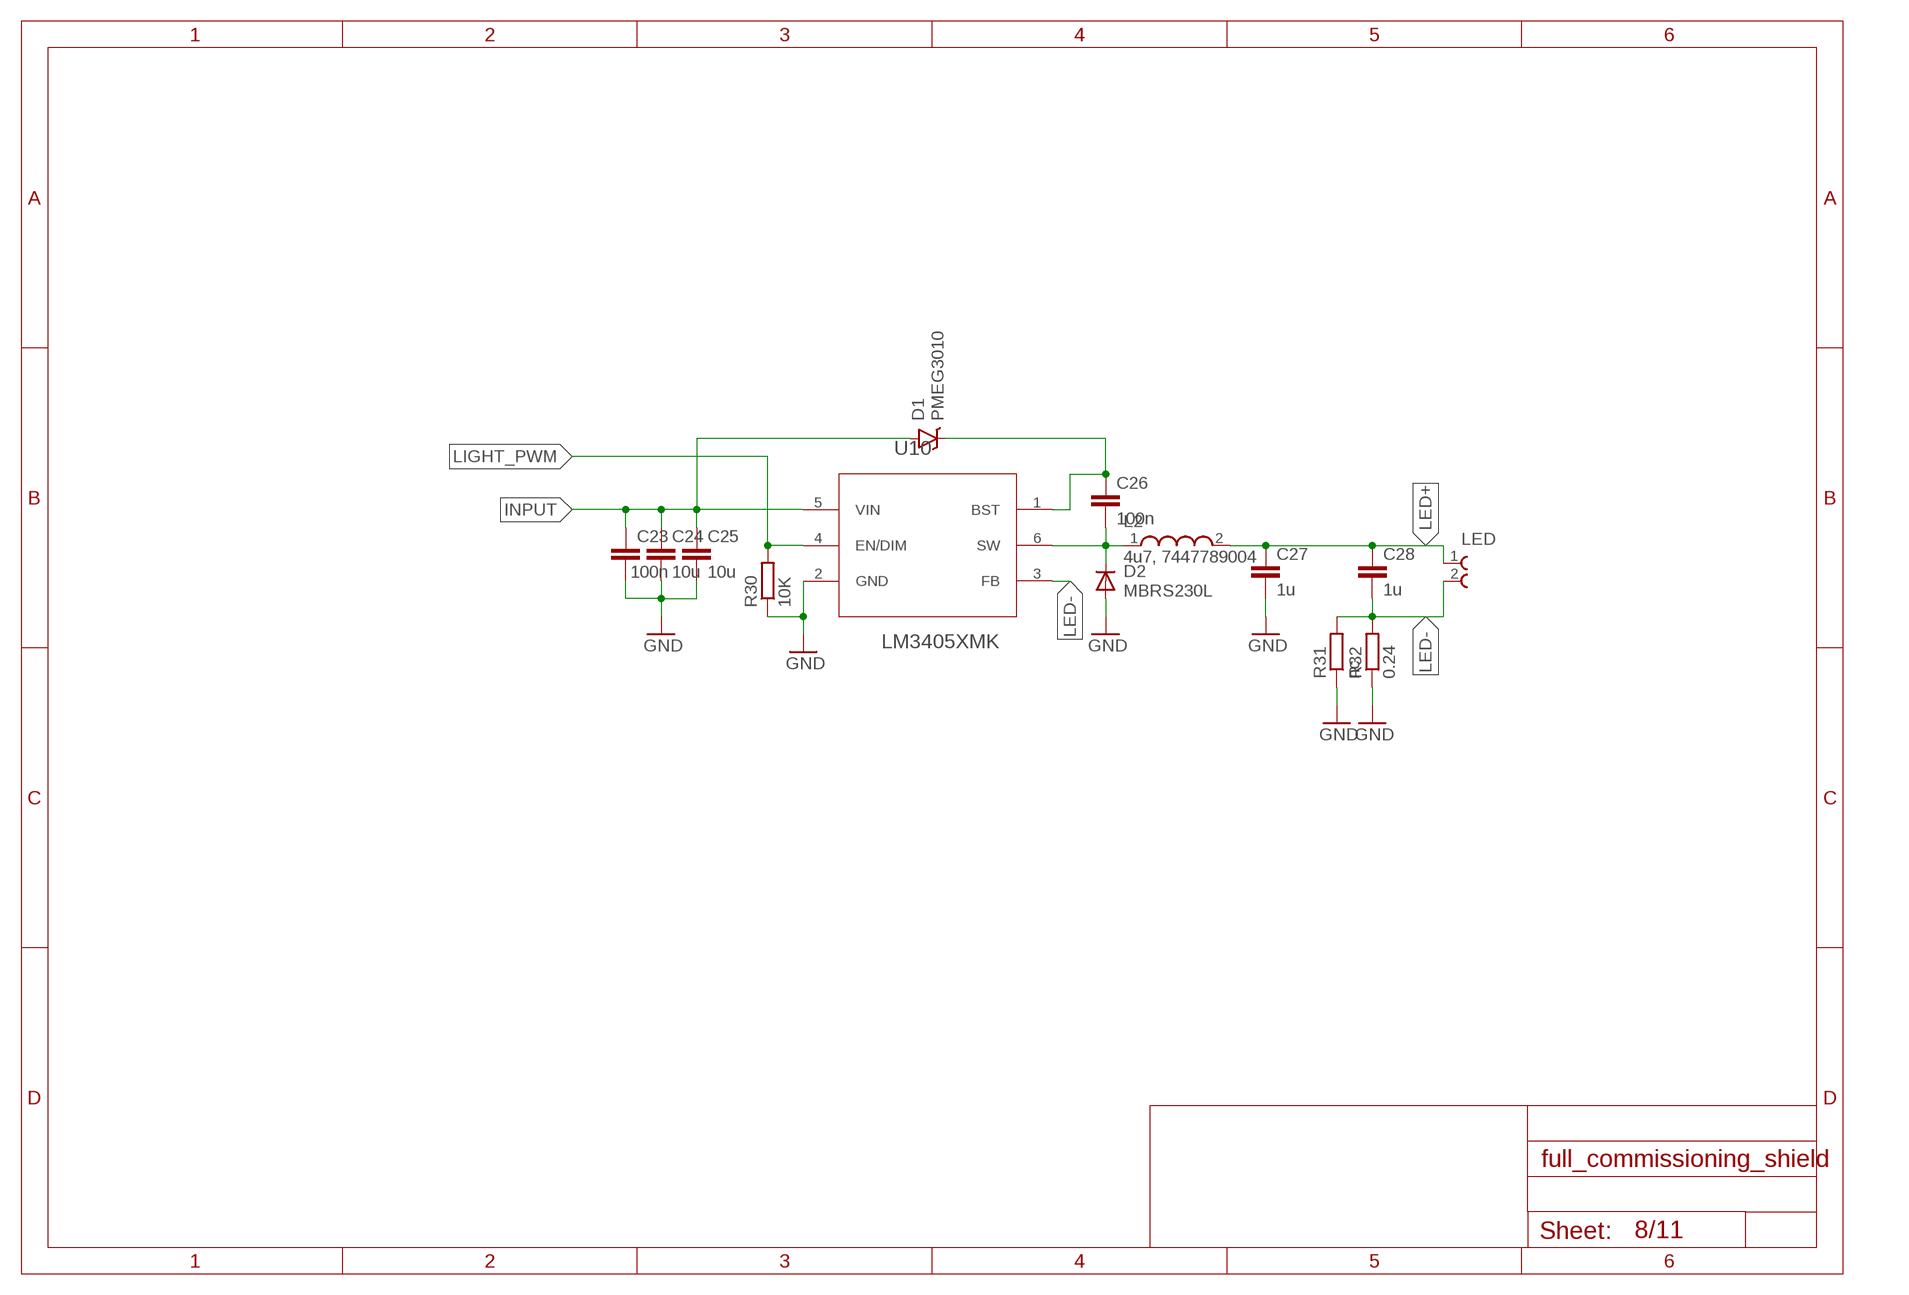
[diagram p7: schematic, sheet 8]

### Parts
C23  100n  C-EUC0805  [C0805]
C24  10u  C-EUC1206  [C1206]
C25  10u  C-EUC1206  [C1206]
C26  100n  C-EUC0805  [C0805]
C27  1u  C-EUC0805  [C0805]
C28  1u  C-EUC0805  [C0805]
D1  PMEG3010  BAT20JFILM  [SOD-323]
D2  MBRS230L  DIODE-SMB  [SMB]
L2  4u7, 7447789004  WE-PD_7332/7345  [WE-PD_7332/7345]
LED  691236510002  [691236510002]
R30  10K  R-EU_R0805  [R0805]
R31  nc  R-EU_R1206  [R1206]
R32  0.24  R-EU_R1206  [R1206]
U10  LM3405XMK  [SOT95P285X100-6N]

### Nets
GND: C23.1 C24.2 C25.2 C27.2 D2.A R30.1 R31.1 R32.1 U10.2(GND) ; also sheet 1,2,3,4,5,6,7,9,10,11
INPUT: C23.2 C24.1 C25.1 D1.A U10.5(VIN) ; also sheet 2
LED+: C27.1 C28.1 L2.2 LED.1
LED-: C28.2 LED.2 R31.2 R32.2 U10.3(FB)
LIGHT_PWM: R30.2 U10.4(EN/DIM) ; also sheet 1
N$19: C26.2 D2.C L2.1 U10.6(SW)
N$20: C26.1 D1.C U10.1(BST)

## Sheet 9 of 11: RTC
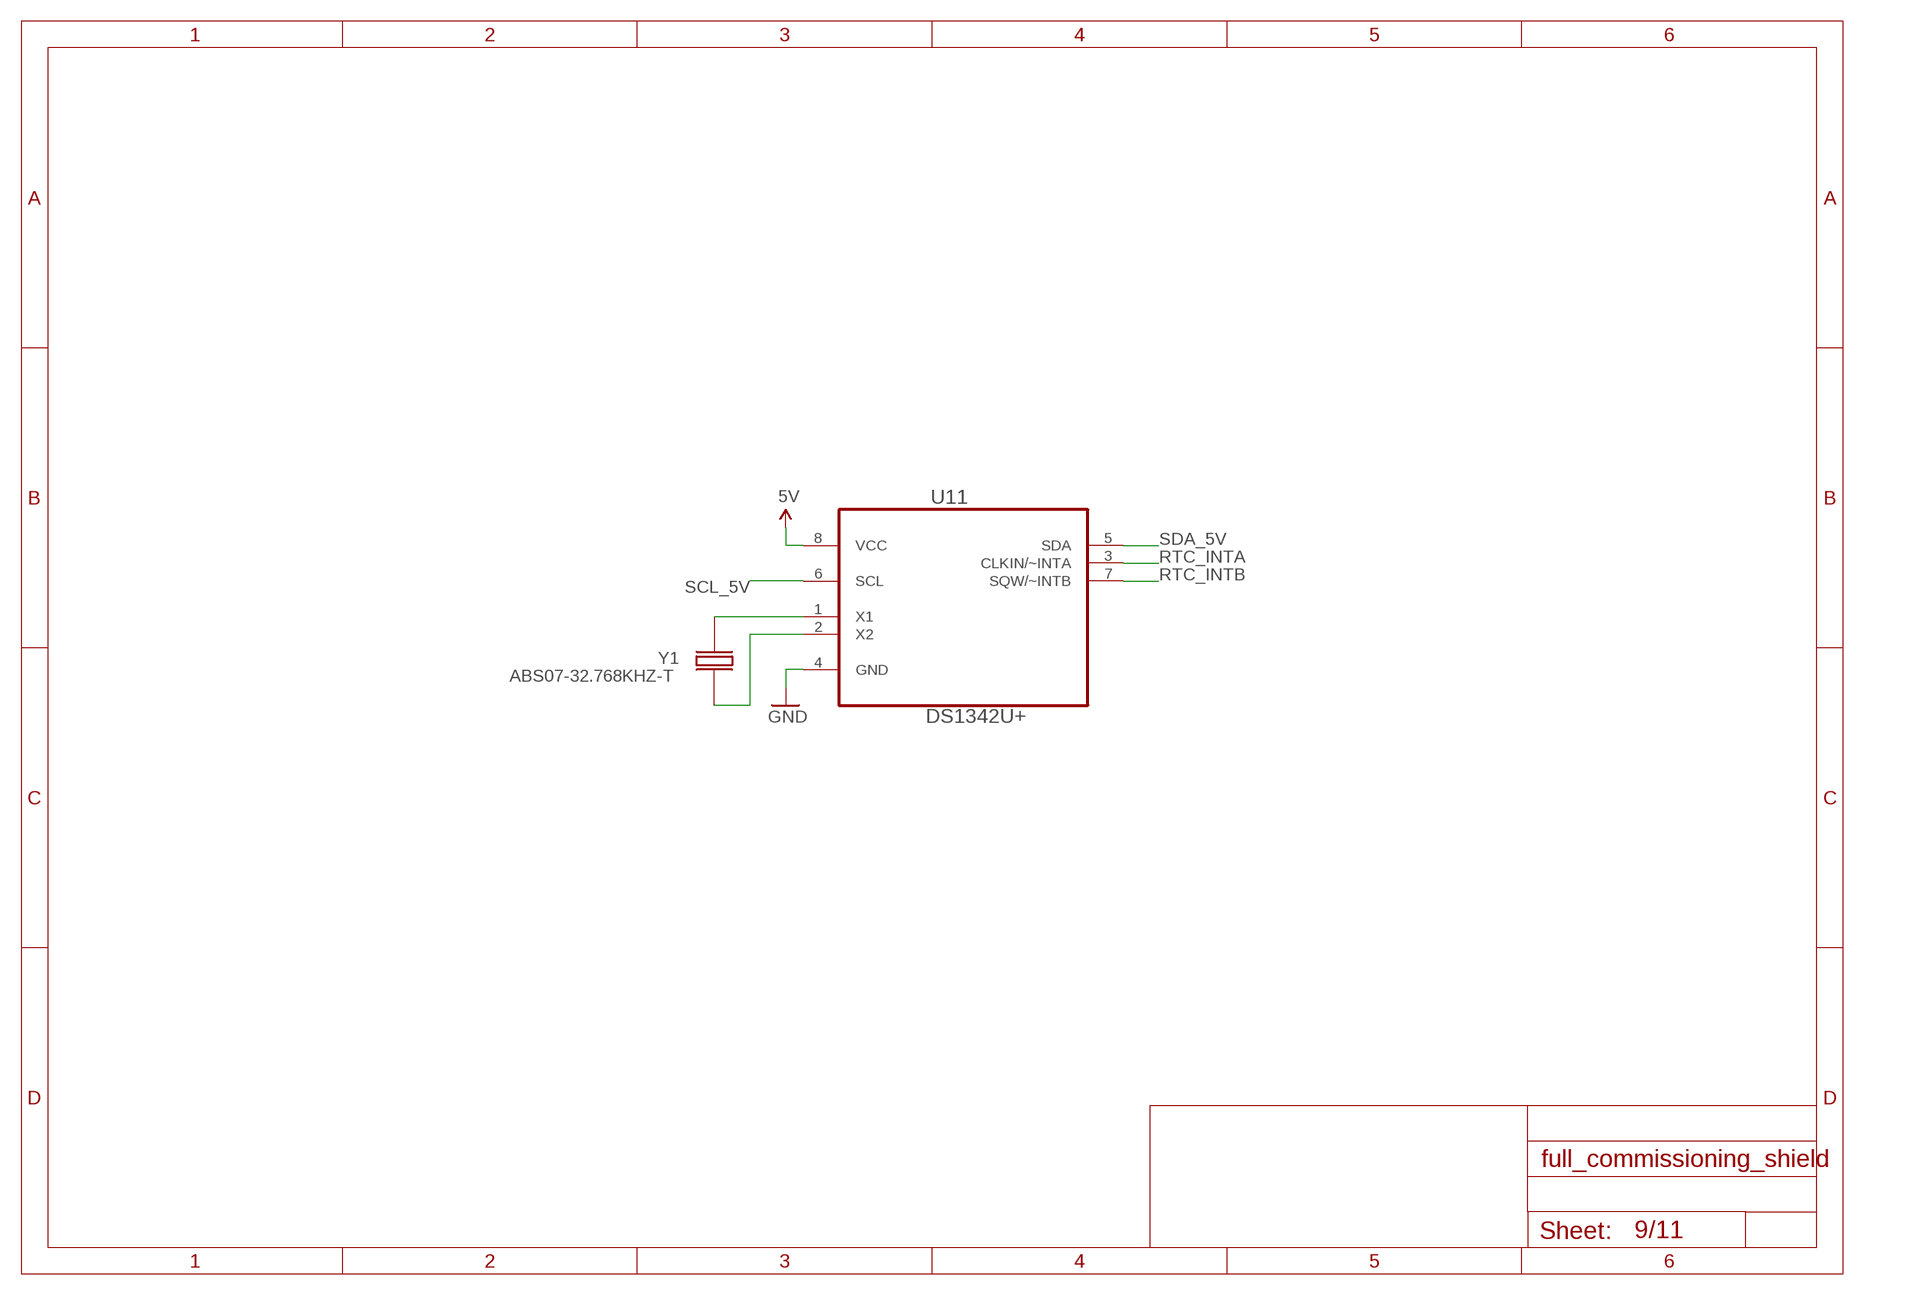
[diagram p8: schematic, sheet 9]

### Parts
U11  DS1342U+  DS1341U+  [SOP65P490X110-8N]
Y1  ABS07-32.768KHZ-T  CM7V-T1A  [CM7V-T1A]

### Nets
+5V: U11.8(VCC) ; supply symbol labelled 5V ; also sheet 1,2,3,6,10
GND: U11.4(GND) ; also sheet 1,2,3,4,5,6,7,8,10,11
N$23: U11.2(X2) Y1.P$1
N$24: U11.1(X1) Y1.P$2
RTC_INTA: U11.3(CLKIN/~INTA)
RTC_INTB: U11.7(SQW/~INTB)
SCL_5V: U11.6(SCL) ; also sheet 1
SDA_5V: U11.5(SDA) ; also sheet 1

## Sheet 10 of 11: Microphone
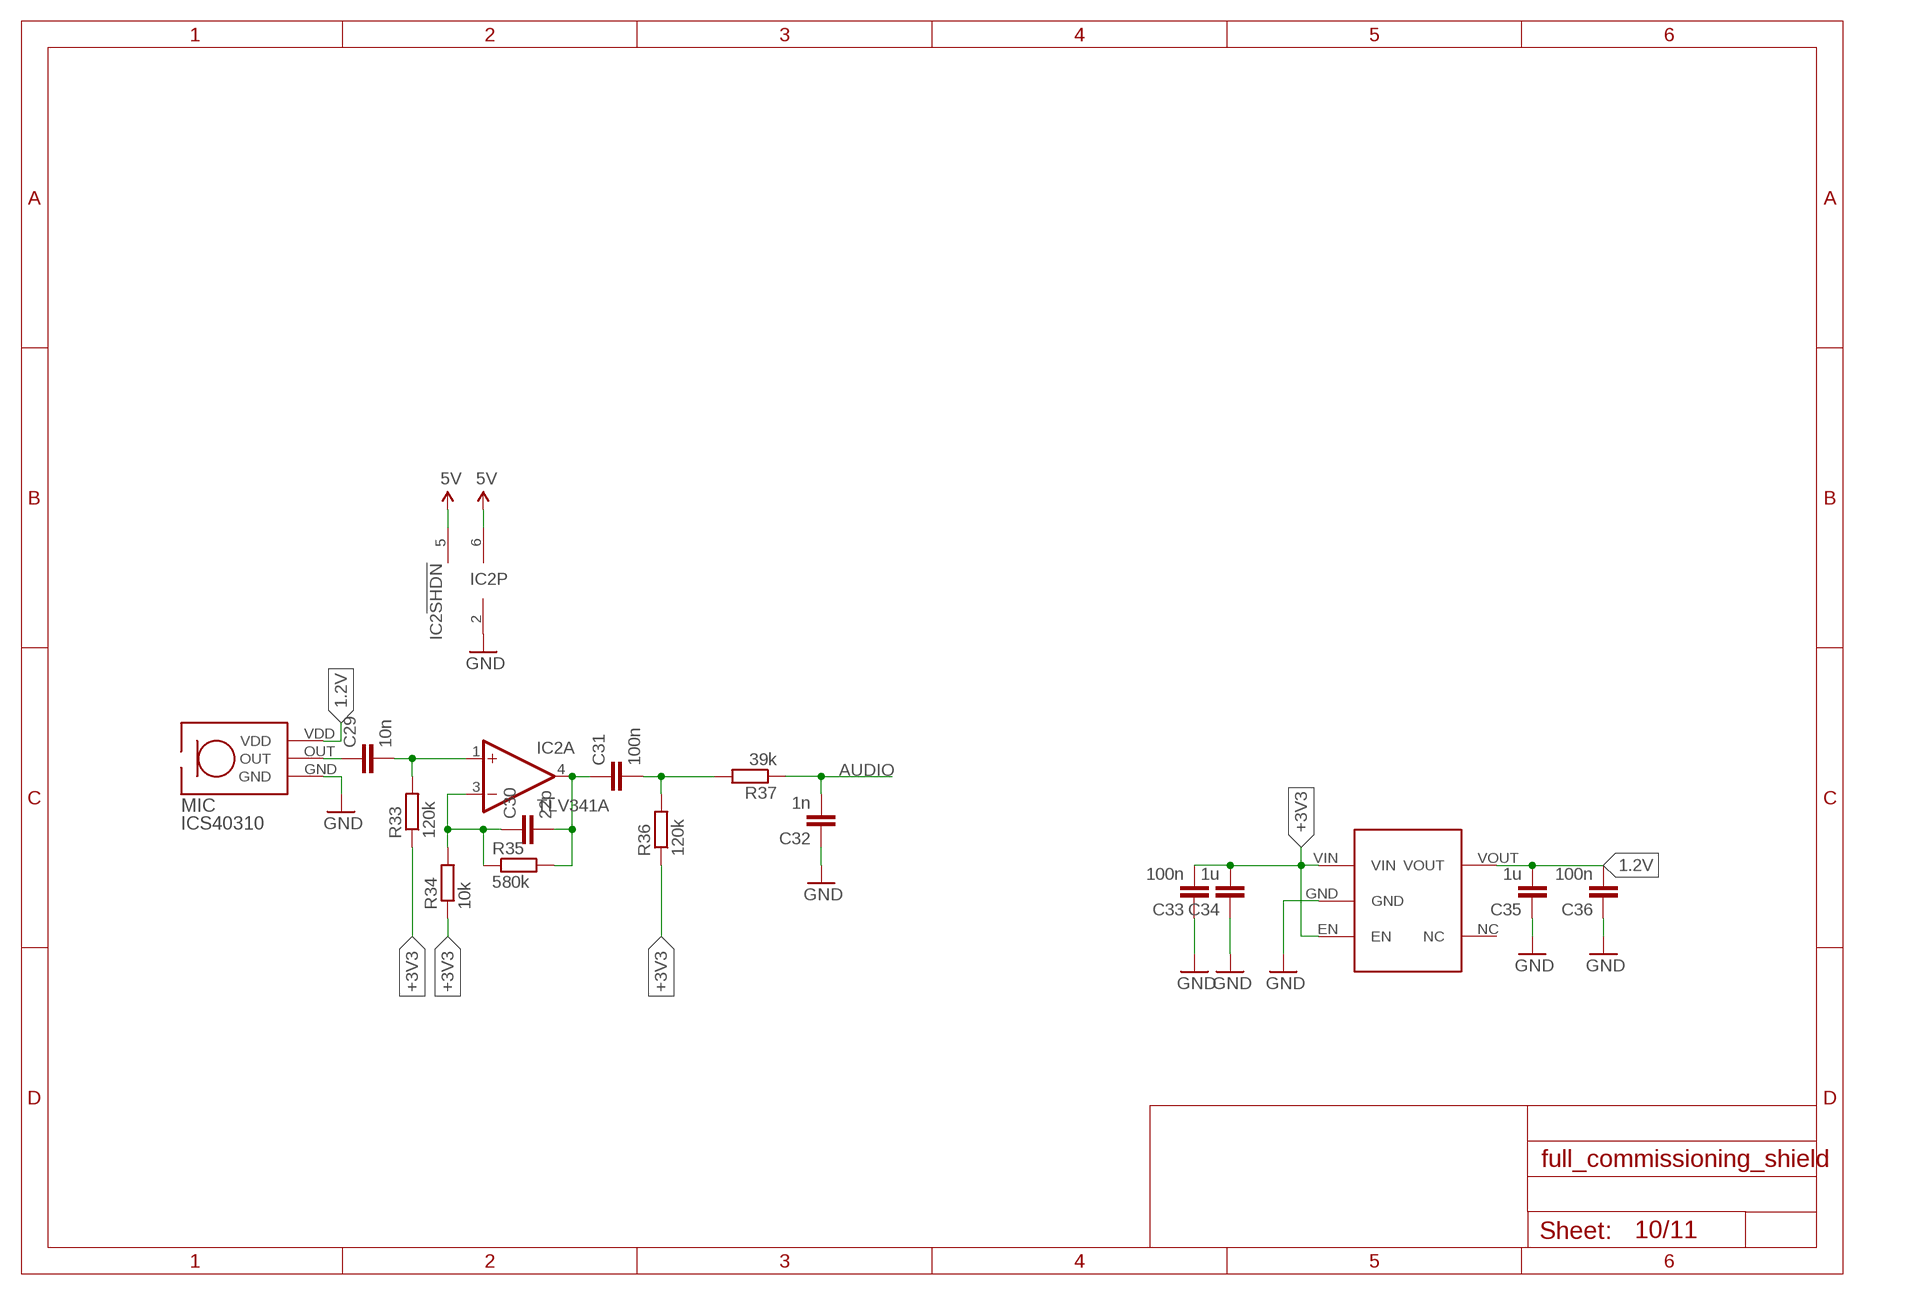
[diagram p9: schematic, sheet 10]

### Parts
C29  10n  C-EUC0805  [C0805]
C30  22p  C-EUC0805  [C0805]
C31  100n  C-EUC0805  [C0805]
C32  1n  C-EUC0805  [C0805]
C33  100n  C-EUC0805  [C0805]
C34  1u  C-EUC0805  [C0805]
C35  1u  C-EUC0805  [C0805]
C36  100n  C-EUC0805  [C0805]
IC2  TLV341A  [SC70-6L]
MIC  ICS40310  [ICS40310]
R33  120k  R-EU_R0805  [R0805]
R34  10k  R-EU_R0805  [R0805]
R35  580k  R-EU_R0805  [R0805]
R36  120k  R-EU_R0805  [R0805]
R37  39k  R-EU_R0805  [R0805]
U14  MIC5365  [SOT95P280X100-5N]

### Nets
1.2V: C35.2 C36.2 MIC.VDD U14.VOUT
5V: IC2.5(!SHDN:!SHDN)
+3V3: C33.2 C34.2 R33.1 R34.1 R36.1 U14.EN U14.VIN ; also sheet 1,3,4,6,7,11
+5V: IC2.6(P:V+) ; supply symbol labelled 5V ; also sheet 1,2,3,6,9
AUDIO: C32.2 R37.1 ; also sheet 1
GND: C32.1 C33.1 C34.1 C35.1 C36.1 IC2.2(P:V-) MIC.GND U14.GND ; also sheet 1,2,3,4,5,6,7,8,9,11
N$26: C29.1 MIC.OUT
N$27: C29.2 IC2.1(A:+IN) R33.2
N$28: C30.1 IC2.3(A:-IN) R34.2 R35.1
N$29: C30.2 C31.1 IC2.4(A:OUT) R35.2
N$30: C31.2 R36.2 R37.2
Unconnected: U14.NC

## Sheet 11 of 11: GPS
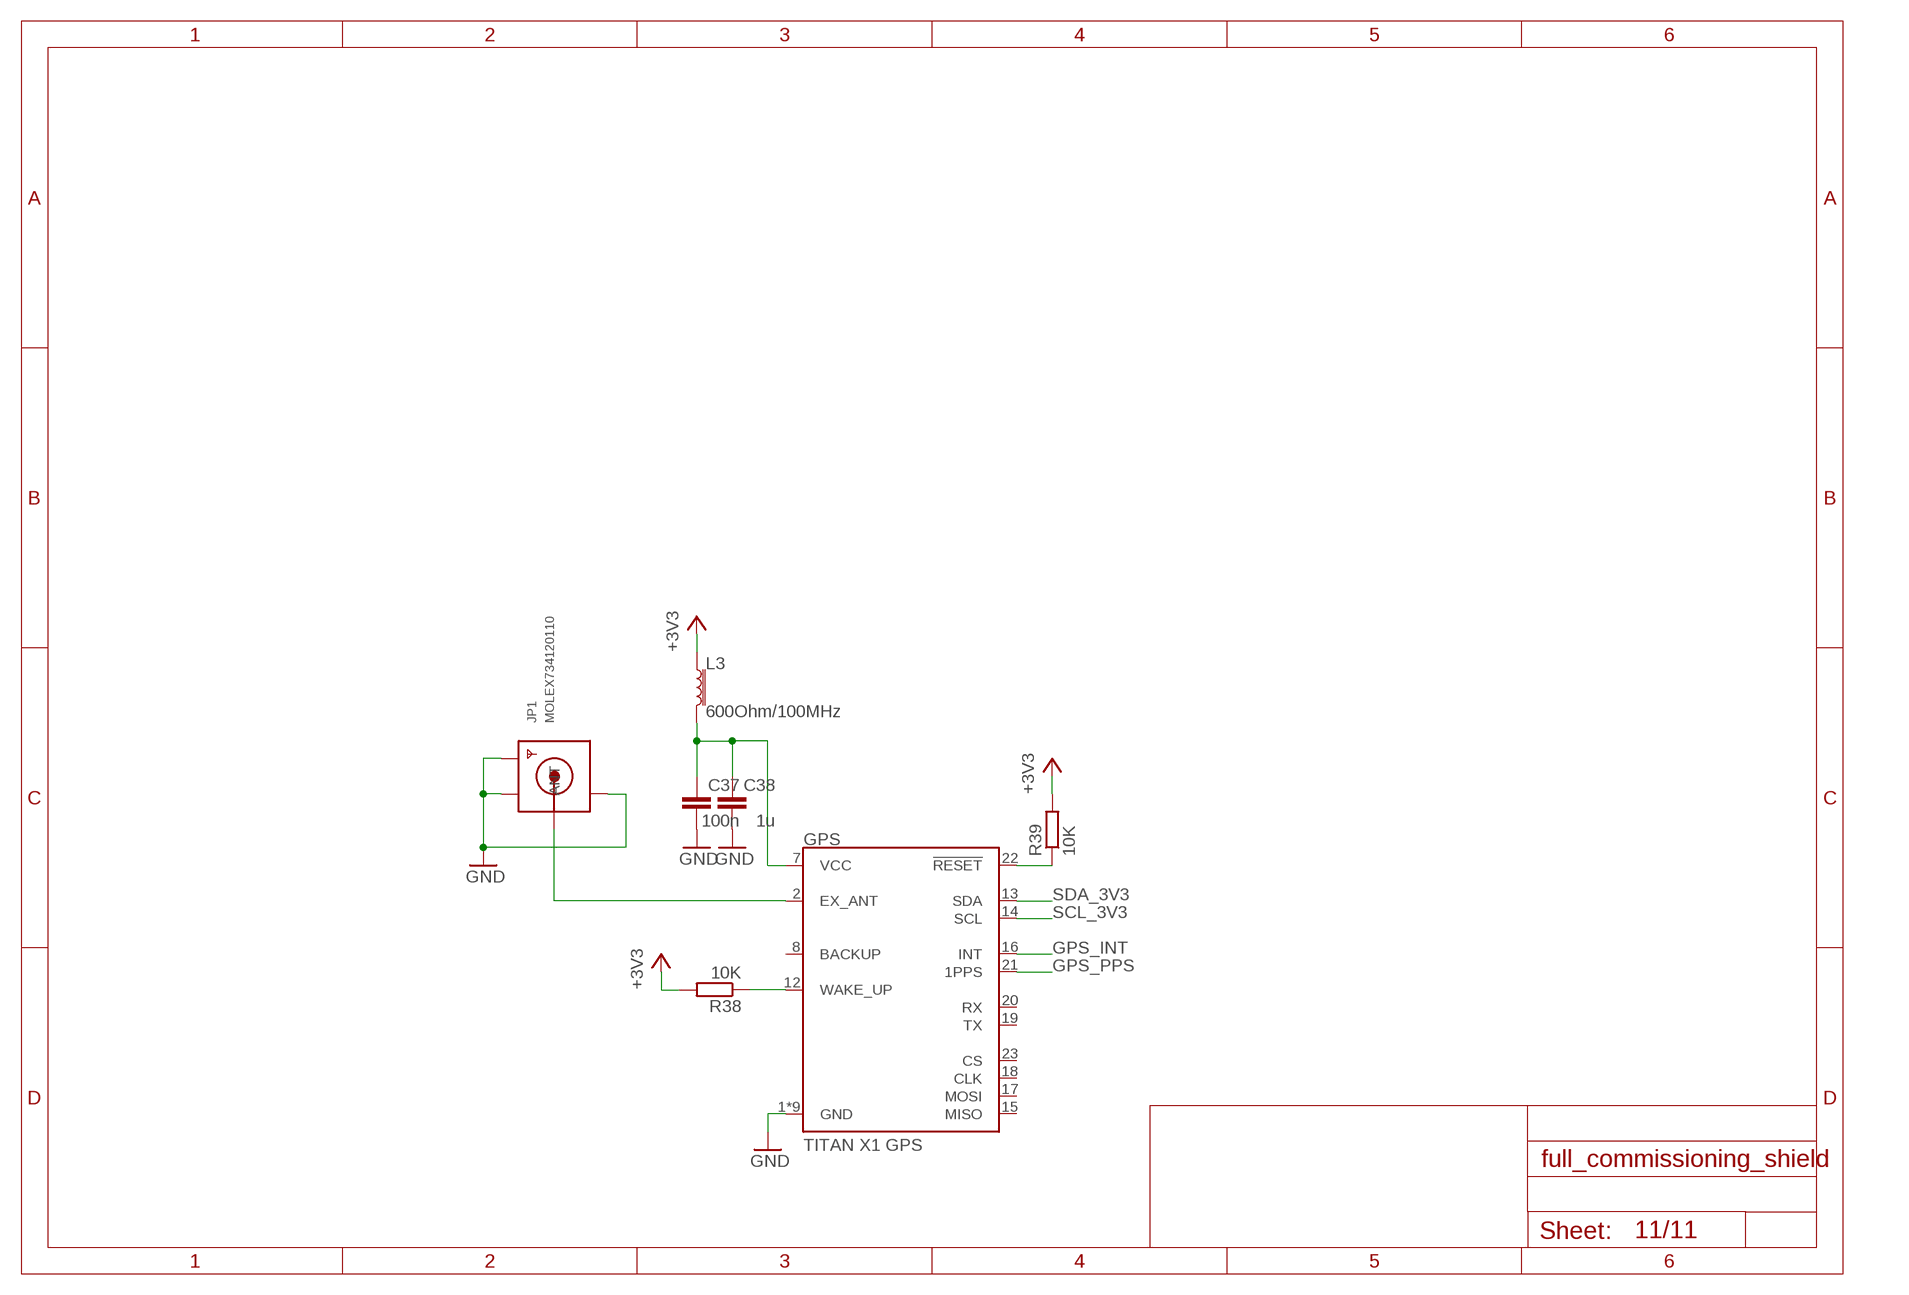
[diagram p10: schematic, sheet 11]

### Parts
C37  100n  C-EUC0805  [C0805]
C38  1u  C-EUC0805  [C0805]
GPS  TITAN X1 GPS  TITAN_X1_GPS  [TITAN_X1_GPS]
JP1  MOLEX734120110  [MICROCOAXIAL]
L3  600Ohm/100MHz  FERRITE_BEAD-0603  [0603]
R38  10K  R-EU_R0805  [R0805]
R39  10K  R-EU_R0805  [R0805]

### Nets
!RESET: GPS.22(!RESET) R39.1
+3V3: L3.1 R38.2 R39.2 ; also sheet 1,3,4,6,7,10
GND: C37.1 C38.1 GPS.1(GND) GPS.3(GND) GPS.4(GND) GPS.5(GND) GPS.6(GND) GPS.9(GND) GPS.10(GND) GPS.11(GND) GPS.24(GND) JP1.GND1 JP1.GND2 JP1.GND3 ; also sheet 1,2,3,4,5,6,7,8,9,10
GPS_INT: GPS.16(INT) ; also sheet 1
GPS_PPS: GPS.21(1PPS)
GPS_WAKEUP: GPS.12(WAKE_UP) R38.1
N$34: C37.2 C38.2 GPS.7(VCC) L3.2
N$35: GPS.2(EX_ANT) JP1.SIGNAL(ANT)
SCL_3V3: GPS.14(SCL) ; also sheet 1,4,6,7
SDA_3V3: GPS.13(SDA) ; also sheet 1,4,6,7
Unconnected: GPS.8(BACKUP) GPS.15(MISO) GPS.17(MOSI) GPS.18(CLK) GPS.19(TX) GPS.20(RX) GPS.23(CS)

## Power pins joined to a net without a drawn wire
GND: ISP1.6(GND)
VCC: ISP1.2(VCC)

## Library data of the parts
C1-C38 = rcl:C-EU: CAPACITOR, European symbol
D1 = SparkFun-DiscreteSemi:BAT20JFILM: 23V, 1A Schottky diode, SOD-323 package; PROD_ID: DIO-11623; VALUE: BAT20JFILM
D2 = diode:DIODE-: DIODE
GPS = SparkX:TITAN_X1_GPS
IC1 = st-microelectronics:LSM303DLHC: Ultra compact high performance e-compass, 3D accelerometer and 3D magnetometer module Source: DM00027543-118326.pdf
IC2 = TLV341A:TLV341A
ISP1 = adafruit:AVRISP: AVR ISP HEADER Standard 6 pin header for AVR programming
JP1 = Design 5:MOLEX734120110
L1 L2 = EagleLibrary_Wuerth_Elektronik_eiSos_rev16a:WE-PD: SMD Shielded Power Inductor Characteristics Magnetically shielded version which results in a low leakage field High Saturation currents up to 25 A Very low self-losses at high switching frequency‘s Wide inductances spectrum available at all sizes Operating temperature: –40 °C to +125 °C Applications Perfectly suitable for switching regulators with extremely high efficiency Integrated DC/DC- converter Switching regulators with low operating voltages (Graphic cards, embedded PC-Cards, Mainboards) Plastic base: Because of the one piece construction these are more suitable for high vibration or shock applications <http://katalog.we-online.de/media/images/eisos/FePBF_pf2.jpg> Details see: http://katalog.we-online.de/en/pbs/WE-PD? Updated by Dan Xu 2014-07-08 2014 (C) Wurth Elektronik
L3 = SparkFun-Coils:FERRITE_BEAD: Ferrite Bead (blocks, cores, rings, chokes, etc.) Inductor with layers of ferrite used to suppress high frequencies. Often used to isolate high frequency noise. SparkFun Products: IOIO-OTG - V2.2 <https://www.sparkfun.com/products/13613> SparkFun SAMD21 Mini Breakout <https://www.sparkfun.com/products/13664> SparkFun 6 Degrees of Freedom Breakout - LSM6DS3 <https://www.sparkfun.com/products/13339> SparkFun SAMD21 Dev Breakout <https://www.sparkfun.com/products/13672>; PROD_ID: NDUC-07859; VALUE: 30Ω/1.8A
LED = EAGLE-TERMINAL_BLOCKS-rev16e:691236510002: SERIE 2365 - 5.08 MM - HORIZONTAL CABLE ENTRY WITH RISING CAGE CLAMP - WR-TBL <http://katalog.we-online.de/media/images/v2/Family_WR-TBL2_6912365100xx.jpg> Details see: http://katalog.we-online.de/en/em/TBL_5_08_2365_HORIZONTAL_ENTRY_W_RISING_CAGE_CLAMP_6912365100xx Created by Yingchun,Shan 2016(C) Wurth Elektronik
LED1-LED7 = adafruit:LED: LED OSRAM: - CHIPLED LG R971, LG N971, LY N971, LG Q971, LY Q971, LO R971, LY R971 LH N974, LH R974 LS Q976, LO Q976, LY Q976 LO Q996 - Hyper CHIPLED LW Q18S LB Q993, LB Q99A, LB R99A - SideLED LS A670, LO A670, LY A670, LG A670, LP A670 LB A673, LV A673, LT A673, LW A673 LH A674 LY A675 LS A676, LA A676, LO A676, LY A676, LW A676 LS A679, LY A679, LG A679 - Hyper Micro SIDELED® LS Y876, LA Y876, LO Y876, LY Y876 LT Y87S - SmartLED LW L88C, LW L88S LB L89C, LB L89S, LG L890 LS L89K, LO L89K, LY L89K LS L896, LA L896, LO L896, LY L896 - TOPLED LS T670, LO T670, LY T670, LG T670, LP T670 LSG T670, LSP T670, LSY T670, LOP T670, LYG T670 LG T671, LOG T671, LSG T671 LB T673, LV T673, LT T673, LW T673 LH T674 LS T676, LA T676, LO T676, LY T676, LB T676, LH T676, LSB T676, LW T676 LB T67C, LV T67C, LT T67C, LS T67K, LO T67K, LY T67K, LW E67C LS E67B, LA E67B, LO E67B, LY E67B, LB E67C, LV E67C, LT E67C LW T67C LS T679, LY T679, LG T679 LS T770, LO T770, LY T770, LG T770, LP T770 LB T773, LV T773, LT T773, LW T773 LH T774 LS E675, LA E675, LY E675, LS T675 LS T776, LA T776, LO T776, LY T776, LB T776 LHGB T686 LT T68C, LB T68C - Hyper Mini TOPLED® LB M676 - Mini TOPLED Santana® LG M470 LS M47K, LO M47K, LY M47K Source: http://www.osram.convergy.de/
MIC = invensense:ICS40310
NFC = M24SR:M24SR
POWER = EAGLE-WR-DC_POWER_JACK_CONNECTORS-rev17a:694108301002: WR-DC_DC Power Jack_Right Angled_THT Center Pin Ø2.5_Plug ID Ø2.05_Plug OD Ø5.5 ;=>Code : Con_WR-DC_THT_694108301002_694108301002 <http://katalog.we-online.de/media/images/eican/Con_WR-DC_THT_694108301002_pf2.jpg> Details see: http://katalog.we-online.de/em/datasheet/6941xx301002.pdf Created 2014-10-08, Karrer Zheng 2014 (C) Wurth Elektronik
Q1 Q2 = SparkFun:MOSFET-NCHANNEL
Q3 = AirSpark:MOSFET-NCHANNEL
R1-R4 R9-R29 = resistor:R-EU_: RESISTOR, European symbol
R5-R8 R30-R39 = rcl:R-EU_: RESISTOR, European symbol
S1 S2 = EAGLE-TACT_SWITCHES-rev17b:434111043826: 6.0x3.5 mm SMD WS-TASV <http://katalog.we-online.de/media/images/v2/Family_WS-TASV_6.0x3.jpg> Details see: http://katalog.we-online.de/em/datasheet/4341x1xxx8x6.pdf 2015 (C) Wurth Elektronik
S3 = smd-special:SWS006: SMD Dip Switch 6 pol.
U2 = microchip_bluetooth_v101:RN4020
U3 = adafruit:TXB0108PWR: 8-Bit Bi-Directional Level Shifter 1.2V-3.6V (VCCA) to 1.65V-5.5V (VCCB) bi-directional level shifter with auto direction sensing. Max data rate - VCCA 1.8V: 20Mbps (50ns), VCCA 3.3V: 100Mbps (10ns) Digikey: 296-21527-1-ND
U4 = SparkFun-Sensors:SI7021: The Si7021 is an I2C Humidity and Temperature Sensor; PROD_ID: IC-13093
U5 = APDS-9007-020:APDS-9007-020: Sensor: ambient light photo; Usup: 2.4/5.5VDC; Mounting: SMT; AVAILABILITY: Good; DESCRIPTION: Sensor%3A ambient light photo%3B Usup%3A 2.4/5.5VDC%3B Mounting%3A SMT; MF: Avago; MP: APDS-9007-020; PACKAGE: SMD-6 Avago; PRICE: 0.77 USD
U6 = AirSpark:MICS-4514: Metal oxide MEMS carbon monoxide (CO) and NOx sensor in an SMD package.; PROD_ID: COMP-12310
U7 = adam - ics:MCP6001: General Op Amp 1.8V min supply 1MHz (6V/us)
U8 = SparkFun-Sensors:MICS-2614: Metal oxide MEMS ozone (O3) sensor in an SMD package.; PROD_ID: COMP-12309
U9 = SparkFun-Sensors:MPL3115A2: Altimeter/Pressure Sensor, I2C, 1.95V-3.6V supply, 50 to 110kPa; PROD_ID: IC-10869
U10 = LM3405:LM3405XMK: Constant Current Buck Regulator; MPN: LM3405XMK; OC_FARNELL: 1359697; OC_NEWARK: 32M1070; PACKAGE: SOT-6; SUPPLIER: National Semiconductor
U11 = Maxim_By_element14_Batch_1:DS1341U+: Low-Current I2C RTCs for High-ESR Crystals; MPN: DS1341U+; OC_FARNELL: -; OC_NEWARK: 68R0489; PACKAGE: SOP-8; SUPPLIER: Maxim
U12 = SparkFun-Boards:ARDUINO-MEGA: Arduino Mega board footprint
U13 = TPS563200:TPS563200
U14 = mic5365:MIC5365
Y1 = Design 5:CM7V-T1A

## Board
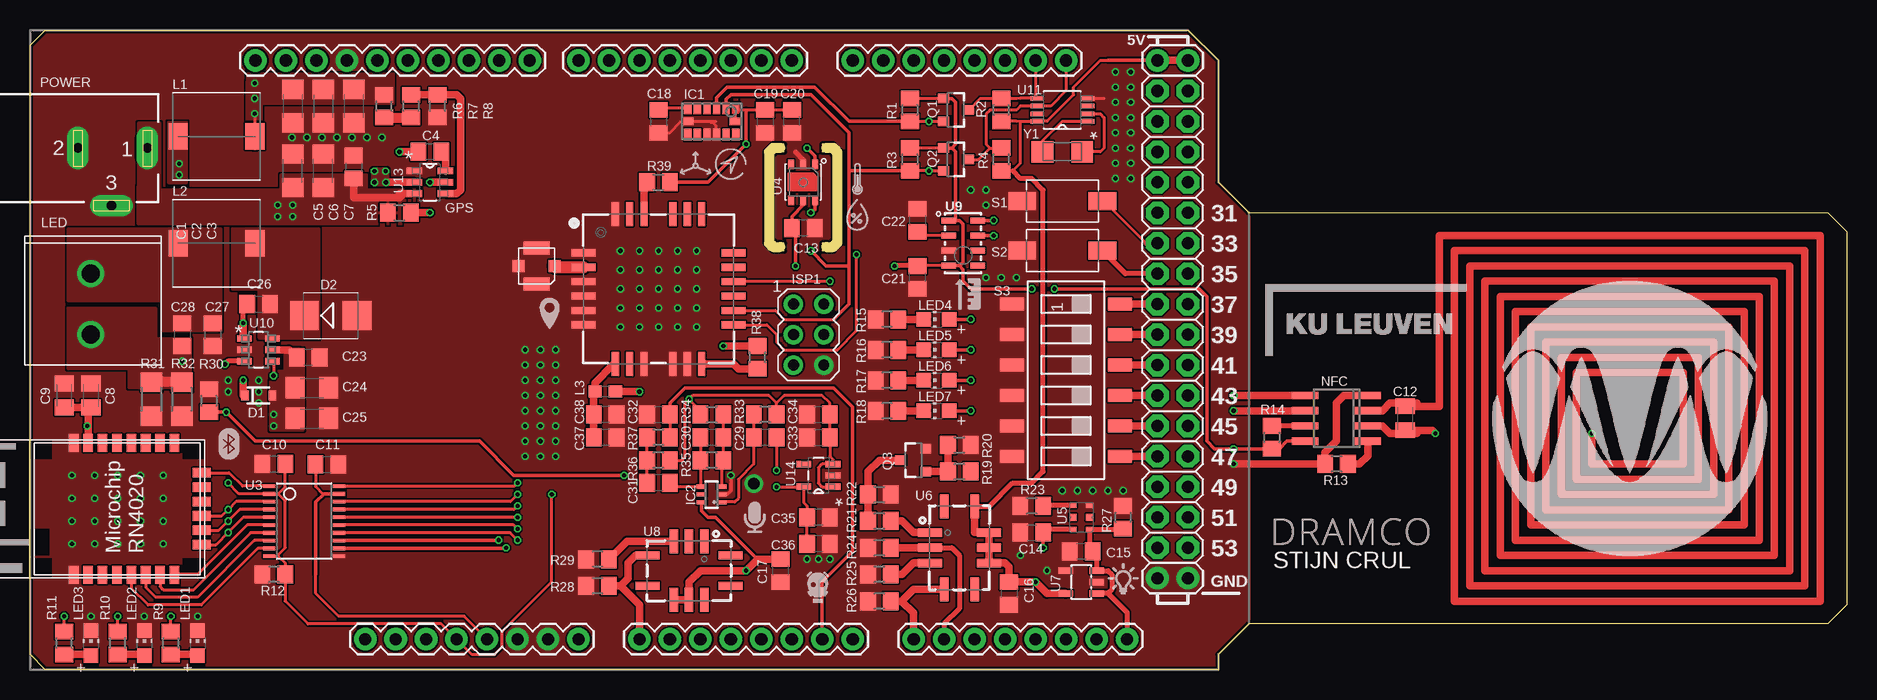
[diagram p11: board, top side]
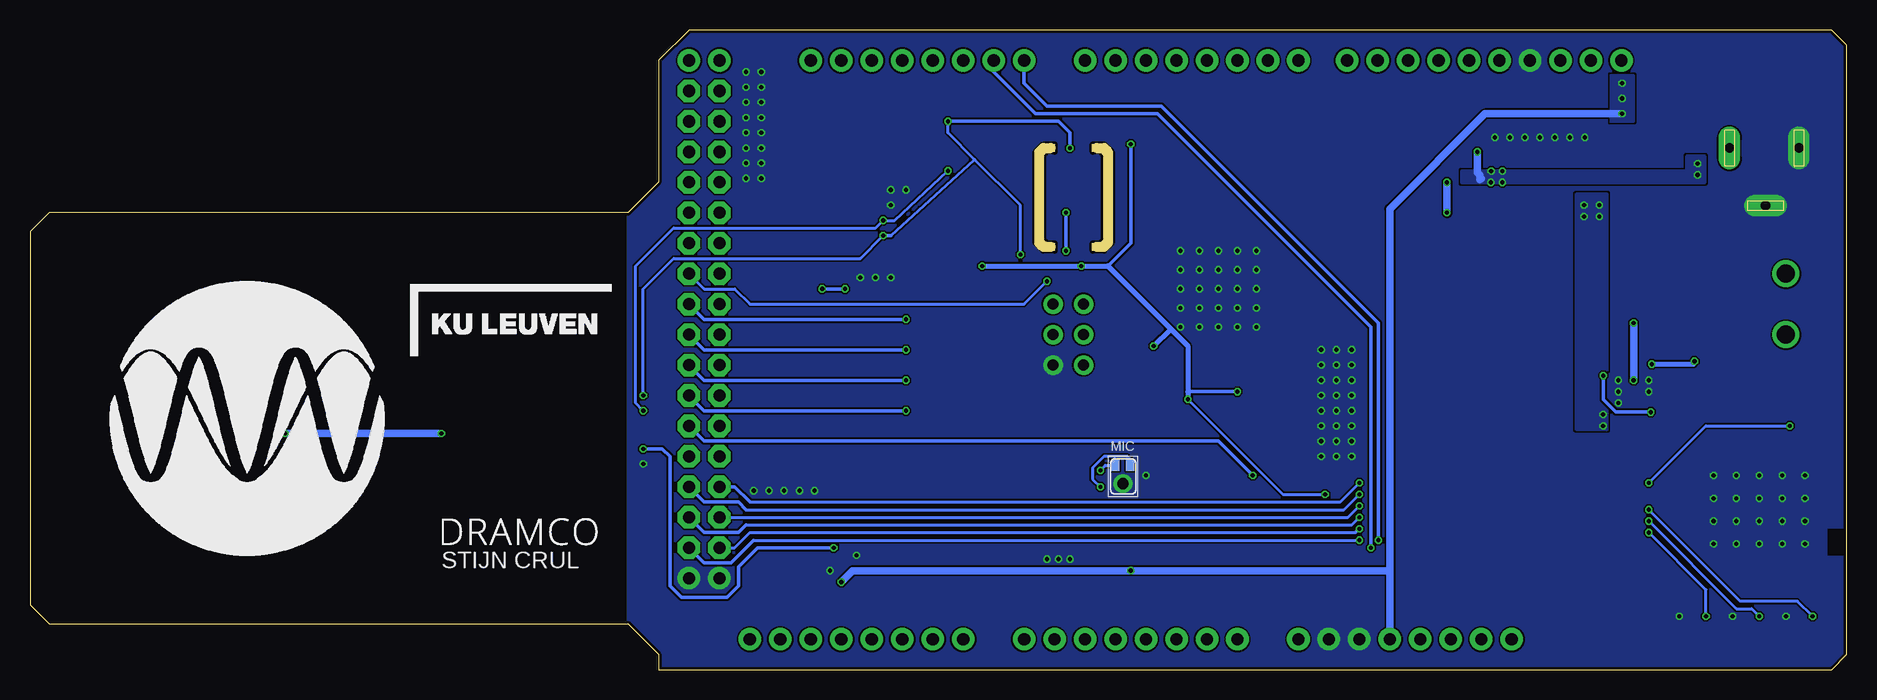
[diagram p12: board, bottom side, seen from below]

Size 151.45 x 53.34 mm. Coordinates in mm from the lower left corner, seen from the top.
Outline: 0,52.07 1.27,53.34 96.52,53.34 99.06,50.8 99.06,40.64 101.6,38.1 149.86,38.1 151.45,36.51 151.45,5.4 149.86,3.81 101.6,3.81 99.06,1.27 99.06,0 1.27,0 0,1.27 0,52.07
Outline: 62.87,43.18 62.87,43.81 61.91,43.81 61.28,43.18 61.28,35.56 61.91,34.92 62.87,34.92 62.87,35.56 62.23,35.56 61.91,35.88 61.91,42.86 62.23,43.18 62.87,43.18
Outline: 66.04,43.81 66.04,43.18 66.67,43.18 66.99,42.86 66.99,35.88 66.67,35.56 66.04,35.56 66.04,34.92 66.99,34.92 67.63,35.56 67.63,43.18 66.99,43.81 66.04,43.81
Copper layers (1*16): Top 0.018mm / dielectric 1.55mm / Bottom 0.018mm
Design rules "eC_2Layer_PClass6_BaseCopperO18_eCDefault": minimum track width 0.15mm, minimum drill 0.35mm, track to track 0.15mm, track to pad 0.15mm, pad to pad 0.15mm, via to via 0.15mm, smd to smd 0mil, copper to edge 0.25mm, drill to drill 0.35mm, minimum pad ring 0.175mm, minimum via ring 0.125mm, stop-mask expansion 0mil, vias tented up to drill 0.45mm, thermal gap 0.2mm
Milling: 10 lines

### Footprints (pad centres in the part's own frame; a part is rotated, then mirrored left to right if it is on the bottom)
C1206 = smd 1.6 x 1.8: 1 -1.4,0; 2 1.4,0
C0805 = smd 1.3 x 1.5: 1 -0.95,0; 2 0.95,0
C0805K = smd 1.3 x 1.6: 1 -1,0; 2 1,0
SOD-323 = smd 0.63 x 0.83: A 1.15,0; C -1.15,0
SMB = smd 2.4 x 2.4: A 2.2,0; C -2.2,0
TITAN_X1_GPS = smd 2 x 0.6: 1 -6.25,3; 2 -6.25,1.8; 3 -6.25,0.6; 4 -6.25,-0.6; 5 -6.25,-1.8; 6 -6.25,-3; 13 6.25,-3; 14 6.25,-1.8; 15 6.25,-0.6; 16 6.25,0.6; 17 6.25,1.8; 18 6.25,3 | smd 0.6 x 2: 7 -3.6,-6.25; 8 -2.4,-6.25; 9 -1.2,-6.25; 10 1.2,-6.25; 11 2.4,-6.25; 12 3.6,-6.25; 19 3.6,6.25; 20 2.4,6.25; 21 1.2,6.25; 22 -1.2,6.25; 23 -2.4,6.25; 24 -3.6,6.25
LGA-14 = smd 0.4 x 0.4: 1 -2,-1.1 | smd 0.6 x 1: 2 -1.2,-1.1; 3 -0.4,-1.1; 4 0.4,-1.1; 5 1.2,-1.1; 6 2,-1.1; 8 2,1.1; 9 1.2,1.1; 10 0.4,1.1; 11 -0.4,1.1; 12 -1.2,1.1; 13 -2,1.1 | smd 1 x 0.6: 7 2,0; 14 -2,0
SC70-6L = smd 0.35 x 0.8: 1 -0.65,-0.85; 2 0,-0.85; 3 0.65,-0.85; 4 0.65,0.85; 5 0,0.85; 6 -0.65,0.85
AVRISP = drill 0.9 pad 1.626: 1 -1.27,2.54; 2 1.27,2.54; 3 -1.27,0; 4 1.27,0; 5 -1.27,-2.54; 6 1.27,-2.54
MICROCOAXIAL = smd 1.05 x 2.2: GND1 -1.5,0; GND3 1.5,0 | smd 1 x 1: GND2 0,1.5; SIGNAL 0,-1.5
WE-PD_7332/7345 = smd 1.6 x 2.2: 1 -3.2,0; 2 3.2,0
0603 = smd 1.1 x 1: 1 -0.85,0; 2 0.85,0
691236510002 = drill 1.5: 1 -2.54,0; 2 2.54,0
CHIP-LED0805 = smd 1.2 x 1.2: A 0,-1.05; C 0,1.05
ICS40310 = drill 0.95 pad 1.55: GND 2.27,1.25 | smd 0.9 x 0.68: OUT 0.75,0.64; VDD 0.75,1.86
SO8 = smd 2.2 x 0.6: 1 -2.6,1.905; 2 -2.6,0.635; 3 -2.6,-0.635; 4 -2.6,-1.905; 5 2.6,-1.905; 6 2.6,-0.635; 7 2.6,0.635; 8 2.6,1.905
69410X301002 = drill 0.8 pad 1.8 long: 1 13.6,0; 2 7.8,0; 3 10.6,-4.8
SOT23-3 = smd 0.8 x 0.9: 1 -0.95,-1; 2 0.95,-1; 3 0,1.1
R0805 = smd 1.3 x 1.5: 1 -0.95,0; 2 0.95,0
R1206 = smd 1.6 x 1.803: 1 -1.422,0; 2 1.422,0
434111043826 = smd 2.3 x 1.5: 1 -3.35,0; 2 3.35,0
SMS-006 = smd 1.092 x 2.007: 1 -6.35,-4.496; 2 -3.81,-4.496; 3 -1.27,-4.496; 4 1.27,-4.496; 5 3.81,-4.496; 6 6.35,-4.496; 7 6.35,4.496; 8 3.81,4.496; 9 1.27,4.496; 10 -1.27,4.496; 11 -3.81,4.496; 12 -6.35,4.496
RN4020SMD = smd 1.5 x 0.8: P01 0.25,10.9; P02 0.25,9.7; P03 0.25,8.5; P04 0.25,7.3; P05 0.25,6.1; P06 0.25,4.9; P07 0.25,3.7; P08 0.25,2.5; P17 11.25,2.5; P18 11.25,3.7; P19 11.25,4.9; P20 11.25,6.1; P21 11.25,7.3; P22 11.25,8.5; P23 11.25,9.7; P24 11.25,10.9 | smd 0.8 x 1.5: P10 2.75,0.25; P11 3.95,0.25; P12 5.15,0.25; P13 6.35,0.25; P14 7.55,0.25; P15 8.75,0.25
TSSOP20 = smd 0.305 x 0.991: 1 -2.925,-2.918; 2 -2.275,-2.918; 3 -1.625,-2.918; 4 -0.975,-2.918; 5 -0.325,-2.918; 6 0.325,-2.918; 7 0.975,-2.918; 8 1.625,-2.918; 9 2.275,-2.918; 10 2.925,-2.918; 11 2.925,2.918; 12 2.275,2.918; 13 1.625,2.918; 14 0.975,2.918; 15 0.325,2.918; 16 -0.325,2.918; 17 -0.975,2.918; 18 -1.625,2.918; 19 -2.275,2.918; 20 -2.925,2.918
SI7021 = smd 0.8 x 0.5: DATA 1.5,-1; GND 1.5,0; NC@3 1.5,1; NC@4 -1.5,1; SCK -1.5,-1; VDD -1.5,0
LCC140P200X240X80-6 = smd 0.4 x 0.6: 1 -1,0.7; 3 1,0.7; 4 1,-0.7; 6 -1,-0.7 | smd 0.6 x 0.6: 2 0,0.7; 5 0,-0.7
MICS_10-SMD = smd 0.7 x 2: A 1.27,2.45; B 0,2.45; C -1.27,2.45; F -1.27,-2.45; G 0,-2.45; H 1.27,-2.45 | smd 2 x 0.7: D -3.45,1.27; E -3.45,-1.27; J 3.45,-1.27; K 3.45,1.27
SOT23-5 = smd 0.55 x 1.2: 1 -0.95,-1.3; 2 0,-1.3; 3 0.95,-1.3; 4 0.95,1.3; 5 -0.95,1.3
LGA8 = smd 1.2 x 0.5: 1 -1.2,1.875; 2 -1.2,0.625; 3 -1.2,-0.625; 4 -1.2,-1.875; 5 1.2,-1.875; 6 1.2,-0.625; 7 1.2,0.625; 8 1.2,1.875
SOT95P285X100-6N = smd 1.219 x 0.533: 1 -1.168,0.94; 2 -1.168,0; 3 -1.168,-0.94; 4 1.168,-0.94; 5 1.168,0; 6 1.168,0.94
SOP65P490X110-8N = smd 1.067 x 0.356: 1 -2.134,0.965; 2 -2.134,0.33; 3 -2.134,-0.33; 4 -2.134,-0.965; 5 2.134,-0.965; 6 2.134,-0.33; 7 2.134,0.33; 8 2.134,0.965
ARDUINO_MEGA = drill 1.016 pad 1.88: 0 63.5,50.8; 1 60.96,50.8; 2 58.42,50.8; 3 55.88,50.8; 3.3V 35.56,2.54; 3.3V1 30.48,2.54; 3.3V2 27.94,2.54; 4 53.34,50.8; 5 50.8,50.8; 5V@0 38.1,2.54; 5V@1 93.98,50.8; 5V@2 96.52,50.8; 6 48.26,50.8; 7 45.72,50.8; 8 41.656,50.8; 9 39.116,50.8; 10 36.576,50.8; 11 34.036,50.8; 12 31.496,50.8; 13 28.956,50.8; 14 68.58,50.8; 15 71.12,50.8; 16 73.66,50.8; 17 76.2,50.8; 18 78.74,50.8; 19 81.28,50.8; 20 83.82,50.8; 21 86.36,50.8; A0 50.8,2.54; A1 53.34,2.54; A2 55.88,2.54; A3 58.42,2.54; A4 60.96,2.54; A5 63.5,2.54; A6 66.04,2.54; A7 68.58,2.54; A8 73.66,2.54; A9 76.2,2.54; A10 78.74,2.54; A11 81.28,2.54; A12 83.82,2.54; A13 86.36,2.54; A14 88.9,2.54; A15 91.44,2.54; AREF 23.876,50.8; AREF1 18.796,50.8; GND@0 40.64,2.54; GND@1 43.18,2.54; GND@2 93.98,7.62; GND@3 96.52,7.62; GND@4 26.416,50.8; GND@5 21.336,50.8; RESET 33.02,2.54; VIN 45.72,2.54 | drill 1.016 pad 1.88 octagon: 22 93.98,48.26; 23 96.52,48.26; 24 93.98,45.72; 25 96.52,45.72; 26 93.98,43.18; 27 96.52,43.18; 28 93.98,40.64; 29 96.52,40.64; 30 93.98,38.1; 31 96.52,38.1; 32 93.98,35.56; 33 96.52,35.56; 34 93.98,33.02; 35 96.52,33.02; 36 93.98,30.48; 37 96.52,30.48; 38 93.98,27.94; 39 96.52,27.94; 40 93.98,25.4; 41 96.52,25.4; 42 93.98,22.86; 43 96.52,22.86; 44 93.98,20.32; 45 96.52,20.32; 46 93.98,17.78; 47 96.52,17.78; 48 93.98,15.24; 49 96.52,15.24; 50 93.98,12.7; 51 96.52,12.7; 52 93.98,10.16; 53 96.52,10.16
SOT95P280X145-6N = smd 1.27 x 0.559: 1 -1.295,0.94; 2 -1.295,0; 3 -1.295,-0.94; 4 1.295,-0.94; 5 1.295,0; 6 1.295,0.94
SOT95P280X100-5N = smd 1.219 x 0.508: EN -1.219,-0.94; GND -1.219,0; NC 1.219,-0.94; VIN -1.219,0.94; VOUT 1.219,0.94
CM7V-T1A = smd 1.8 x 1.8: P$1 -1.65,0; P$2 1.65,0

### Placement (x,y rotation side)
C1  21.91,41.59 90 top
C2  24.45,41.59 90 top
C3  26.99,41.91 270 top
C4  33.34,43.18 180 top
C5  21.91,46.99 270 top
C6  24.45,46.99 270 top
C7  26.99,46.99 270 top
C8  5.08,22.86 270 top
C9  2.86,22.86 270 top
C10  20.34,17.16 0 top
C11  24.74,17.1 0 top
C12  114.62,20.95 270 top
C13  64.45,36.83 180 top
C14  83.5,11.43 0 top
C15  87.63,9.84 180 top
C16  81.6,6.35 270 top
C17  62.55,8.26 270 top
C18  52.39,45.72 270 top
C19  61.28,45.72 270 top
C20  63.5,45.72 90 top
C21  73.98,32.7 90 top
C22  73.98,37.47 270 top
C23  23.19,26.03 180 top
C24  23.5,23.5 0 top
C25  23.5,20.95 0 top
C26  19.05,30.48 0 top
C27  15.24,27.94 270 top
C28  12.7,27.94 270 top
C29  61.28,19.37 180 top
C30  56.83,19.37 180 top
C31  52.39,15.56 180 top
C32  52.39,21.27 0 top
C33  65.72,19.37 0 top
C34  65.72,21.27 0 top
C35  65.72,12.7 180 top
C36  65.72,10.48 180 top
C37  47.94,19.37 180 top
C38  47.94,21.27 180 top
D1  19.05,22.86 0 top
D2  25.08,29.53 0 top
GPS  52.39,31.75 0 top
IC1  56.83,45.72 180 top
IC2  56.83,14.61 90 top
ISP1  64.9,27.94 0 top
JP1  42.23,33.66 90 top
L1  15.56,44.45 0 top
L2  15.56,35.56 180 top
L3  47.94,23.18 180 top
LED  5.08,30.48 270 top
LED1  13.97,2.22 0 top
LED2  9.53,2.22 0 top
LED3  5.08,2.22 0 top
LED4  75.56,29.21 90 top
LED5  75.56,26.67 90 top
LED6  75.56,24.13 90 top
LED7  75.56,21.59 90 top
MIC  61.59,17.78 270 bottom
NFC  108.9,20.95 180 top
POWER  -3.81,43.5 0 top
Q1  77.15,46.67 270 top
Q2  77.15,42.55 270 top
Q3  73.66,17.46 90 top
R1  73.34,46.67 270 top
R2  80.96,46.67 90 top
R3  73.34,42.55 270 top
R4  80.96,42.55 90 top
R5  30.8,38.1 0 top
R6  29.53,46.99 90 top
R7  31.75,46.99 270 top
R8  33.97,46.99 90 top
R9  11.75,2.22 90 top
R10  7.3,2.22 90 top
R11  2.86,2.22 90 top
R12  20.32,7.94 180 top
R13  108.9,17.14 180 top
R14  103.5,19.37 270 top
R15  71.44,29.21 180 top
R16  71.44,26.67 180 top
R17  71.44,24.13 180 top
R18  71.44,21.59 180 top
R19  77.47,16.51 180 top
R20  77.47,18.73 0 top
R21  70.8,12.38 180 top
R22  70.8,14.61 0 top
R23  83.5,13.65 180 top
R24  70.8,10.16 180 top
R25  70.8,7.94 180 top
R26  70.8,5.71 180 top
R27  91.12,12.7 90 top
R28  47.31,6.99 180 top
R29  47.31,9.21 180 top
R30  14.92,22.42 270 top
R31  10.12,22.55 90 top
R32  12.66,22.55 90 top
R33  61.28,21.27 180 top
R34  56.83,21.27 0 top
R35  56.83,17.46 180 top
R36  52.39,17.46 180 top
R37  52.39,19.37 180 top
R38  60.64,26.04 90 top
R39  52.39,40.64 0 top
S1  86.04,39.05 0 top
S2  86.04,34.92 0 top
S3  86.36,24.13 270 top
U2  14.55,7.67 90 top
U3  22.86,12.38 270 top
U4  64.45,40.64 90 top
U5  87.63,12.7 270 top
U6  77.47,10.16 90 top
U7  87.63,7.3 90 top
U8  54.93,8.26 0 top
U9  77.79,35.56 0 top
U10  19.05,26.67 0 top
U11  86.04,46.67 180 top
U12  0,0 0 top
U13  33.34,40.64 0 top
U14  65.72,16.19 180 top
Y1  86.04,43.18 180 top

### Tracks (layer width: path | path; a pad name or v marks a point on that pad's centre or on a via)
1.2V  (via drill 0.35 pad 0.1)
  Top 0.254: C36.2 C35.2 64.77,13.65 64.5,13.92 U14.VOUT v62.23,15.24
  Bottom 0.254: MIC.VDD 59.73,17.51 60.01,17.78 61.91,17.78 62.87,16.83 62.87,15.88 v62.23,15.24
03
  Top 0.61: U8.D 50.48,9.53 49.85,8.89 49.85,7.62 49.21,6.99 | 49.21,6.99 R28.1 | 49.21,6.99 50.8,5.4 U12.A0
!RESET
  Top 0.61: GPS.22 51.19,40.39 R39.1
+3V3  (via drill 0.35 pad 0.1)
  Top 0.254: R36.1 54.29,17.46 54.61,17.78 54.61,22.23 v54.93,22.54 | R33.1 62.23,22.23 | 62.23,22.23 61.59,22.86 55.24,22.86 v54.93,22.54 | R34.1 55.88,21.59 v54.93,22.54 | Q1.1 R1.1 | Q2.1 R3.1 | C20.2 C19.1 59.69,46.67 58.98,46.67 IC1.1 IC1.14 | U9.4 73.69,33.69 C21.2 | 62.23,22.23 62.86,22.86 66.04,22.86 66.67,22.23 C34.2 C33.2 66.67,17.78 66.94,17.51 U14.EN 66.03,17.13 65.72,16.83 65.72,15.56 66.04,15.24 U14.VIN | 20.69,14.66 U3.2 17.41,14.66 v16.51,15.56 16.56,15.61 | v4.76,20.32 4.85,20.32 | U3.10 20.57,9.46 | 20.57,9.46 21.27,10.16 21.27,14.07 20.69,14.66 | 20.57,9.46 20.7,9.46 21.27,8.89 R12.1 | 20.95,7.94 R12.1 21.27,5.72 23.18,3.81 34.29,3.81 U12.3.3V 36.83,1.27 38.73,1.27 39.37,1.91 39.37,3.17 43.5,7.3 v43.5,14.61 | 20.69,14.66 21.27,15.24 C10.2
  Top 0.305: R39.2 56.52,40.64 v59.69,43.81 59.69,46.67 | R12.1 | U4.VDD 64.45,38.73 63.5,37.78 63.5,37.15 C13.2 63.82,36.83 63.82,34.92 v63.82,33.66 | Q1.1 76.84,47.62 77.15,47.31 77.15,43.81 76.84,43.5 | 76.84,43.5 Q2.1 | 76.84,43.5 77.15,43.18 77.15,37.47 | U9.4 77.47,33.69 | 77.47,33.69 77.5,33.69 77.79,33.97 77.79,37.15 77.47,37.47 77.15,37.47 | 77.15,37.47 76.62,37.47 U9.1 | NFC.8 104.78,19.05 104.14,18.41 R14.2 v100.33,18.42 | v100.33,18.42 v100.33,18.41 | v84.46,10.16 C14.2 | v100.33,18.42 98.74,18.42 98.11,19.05 98.11,31.11 97.47,31.75 v85.41,31.75 | 77.47,33.69 77.79,33.37 77.79,32.38 78.42,31.75 v83.5,31.75
  Top 0.406: U5.4 84.5,11.7 C14.2 | 73.69,33.69 72.1,33.69 v72.07,33.66
  Top 0.61: U2.P23 4.85,20.32 4.85,21.41 C8.2 | 5.4,21.95 C8.2 | C9.2 C8.2 | L3.1 v50.8,23.18 | R38.2 v57.79,26.98 v57.78,26.99
  Bottom 0.254: v16.51,15.56 11.75,20.32 v4.76,20.32 | v54.93,22.54 46.99,14.61 v43.5,14.61
  Bottom 0.305: v50.8,23.18 54.93,23.18 | v84.46,10.16 90.81,10.16 92.39,8.57 92.39,6.99 93.34,6.03 97.16,6.03 98.11,6.99 98.11,17.78 98.74,18.41 v100.33,18.41 | v85.41,31.75 v83.5,31.75 | v59.69,43.81 59.69,35.56 61.59,33.66
  Bottom 0.406: v72.07,33.66 v63.82,33.66 61.59,33.66 56.36,28.42 | 56.36,28.42 54.93,26.99 54.93,23.18 v54.93,22.54 | v57.78,26.99 56.36,28.42
+5V  (via drill 0.35 pad 0.1)
  Top 0.254: 82.56,45.71 U11.8 84.24,45.72 84.77,45.72 87,47.94 87,48.58 89.22,50.8 89.85,50.8 | 82.56,45.71 82.23,45.72 R2.1 | R4.1 81.92,41.59 82.55,42.23 82.55,45.7 82.56,45.71 | C11.1 23.79,15.26 24.39,14.66 24.5,14.66 | L1.2 18.76,46.33 v18.73,46.35 | U12.5V@0 36.2,4.45 25.72,4.45 23.81,6.35 23.81,7.94
  Top 0.305: U12.5V@1 89.85,50.8 | U3.19 24.5,14.66 23.81,13.97 23.81,7.94 | IC2.6 55.98,13.23 56.52,12.7 57.15,12.7 60.64,9.21
  Top 0.406: U6.J 79.97,13.61 81.91,15.56 83.5,15.56 84.46,16.51 84.46,40.01 83.5,40.96 82.56,40.96 81.92,41.59
  Top 0.61: U6.J 78.74,11.43 U6.H U6.G U6.F 81.28,8.89 81.6,8.57 C16.1 v83.82,7.3 84.77,6.35 U7.5 | U12.5V@2 U12.5V@1 | U8.F U8.G 54.93,7.3 55.88,8.26 v59.69,8.26 60.64,9.21 C17.1
  Bottom 0.61: v18.73,46.35 30.16,46.35 38.1,38.42 38.1,8.26 | v83.82,7.3 82.87,8.26 v59.69,8.26 38.1,8.26 | 38.1,8.26 U12.5V@0
  other vias: 18.73,47.62 18.73,48.9
  pour Top (no thermals): 18.13,49.7 30.28,49.7 30.28,47.18 18.13,47.18
  pour Top: 18.07,49.06 18.07,43.44 19.32,43.44 19.32,49.06
  pour Bottom (no thermals): 17.78,49.53 19.69,49.53 19.69,45.72 17.78,45.72
ACTIVITY  (via drill 0.35 pad 0.1)
  Top 0.254: U2.P12 16,12.82 v16.51,13.34 17.18,14.01 U3.3 | R11.2 v2.86,4.45
  Bottom 0.254: v2.86,4.45 4.13,5.71 8.89,5.71 v16.51,13.34
ACTIVITY_ARD  (via drill 0.35 pad 0.1)
  Top 0.254: v40.64,14.61 40.04,14.01 U3.18
  Bottom 0.254: 91.76,13.34 41.91,13.34 v40.64,14.61
  Bottom 0.305: 91.76,13.34 92.39,13.97 95.25,13.97 U12.49
AUDIO
  Top 0.254: R37.1 C32.2
  Top 0.305: C32.2 53.34,22.23 54.61,23.5 66.99,23.5 68.58,21.91 68.58,9.84 66.04,7.3 U12.A6
CO
  Top 0.406: U6.B 76.84,10.16 77.47,9.53 77.47,5.08 76.2,3.81 U12.A9
  Top 0.61: U6.B R24.1
CONN  (via drill 0.35 pad 0.1)
  Top 0.254: U2.P10 15.5,10.42 v16.51,11.43 17.79,12.71 U3.5 | R9.2 v11.75,4.45
  Bottom 0.254: v11.75,4.45 11.75,6.67 v16.51,11.43
CONN_ARD  (via drill 0.35 pad 0.1)
  Top 0.254: v40.64,12.7 v40.63,12.71 U3.16
  Bottom 0.254: 91.76,12.06 41.27,12.06 v40.64,12.7
  Bottom 0.305: U12.51 95.25,11.43 92.39,11.43 91.76,12.06
D36
  Top 0.61: U12.36 S3.12
D38
  Top 0.61: U12.38 S3.11
D40
  Top 0.61: U12.40 S3.10
D42
  Top 0.61: U12.42 S3.9
D44
  Top 0.61: U12.44 S3.8
D46
  Top 0.61: U12.46 S3.7
GND  (via drill 0.35 pad 0.1)
  Top 0.254: U11.4 89.52,47.64 89.53,47.62 | 56.83,45.72 IC1.7 54.29,45.72 53.34,44.77 C18.2 | 56.83,45.72 57.15,45.72 | 56.83,45.72 56.75,45.64 56.91,45.64 57.15,45.4 57.15,45.02 IC1.11
  Top 0.305: IC2.2 58.1,14.61 58.42,14.92 v58.42,16.19 | 107.95,18.1 107.95,17.46 107.63,17.14
  Top 0.406: U4.GND 64.45,42.55 63.82,43.18
  Top 0.61: R13.2 107.95,18.1 108.9,19.05 108.9,22.23 109.54,22.86 NFC.4 | 107.63,17.14 v100.33,17.14
  other vias: 19.05,24.13 21.84,44.38 24.34,44.38 25.59,44.38 26.84,44.38 28.09,44.38 29.34,44.38 23.09,44.38 3.49,16.19 7.3,16.19 11.11,16.19 5.4,16.19 9.21,16.19 9.21,14.29 7.3,14.29 5.4,14.29 3.49,14.29 16.51,24.13 16.51,23.18 19.05,23.18 19.05,22.23 13.97,4.45 9.53,4.45 5.08,4.45 84.77,8.26 82.55,9.53 86.04,14.92 87.31,14.92 88.58,14.92 89.85,14.92 91.12,14.92 66.67,9.21 65.72,9.21 64.77,9.21 79.69,32.7 80.96,32.7 82.23,32.7 79.69,38.73 79.69,40.01 78.42,40.01 90.49,49.85 91.76,49.85 90.49,48.58 91.76,48.58 90.49,47.31 91.76,47.31 91.76,46.04 90.49,46.04 90.49,44.77 91.76,44.77 91.76,43.5 90.49,43.5 90.49,42.23 91.76,42.23 91.76,40.96 90.49,40.96 11.11,14.29 55.56,34.92 53.98,34.92 52.39,34.92 50.8,34.92 49.21,34.92 49.21,33.34 50.8,33.34 52.39,33.34 53.98,33.34 55.56,33.34 55.56,31.75 53.98,31.75 52.39,31.75 49.21,31.75 49.21,30.16 50.8,31.75 50.8,30.16 52.39,30.16 53.98,30.16 55.56,30.16 49.21,28.57 50.8,28.57 52.39,28.57 55.56,28.57 53.98,28.57 11.11,12.38 9.21,12.38 7.3,12.38 5.4,12.38 3.49,12.38 3.49,10.48 5.4,10.48 7.3,10.48 9.21,10.48 11.11,10.48 41.27,26.67 42.55,26.67 43.81,26.67 41.27,21.59 42.55,21.59 43.81,21.59 41.27,25.4 42.55,25.4 43.81,25.4 41.27,24.13 42.55,24.13 43.81,24.13 41.27,22.86 42.55,22.86 43.81,22.86 41.27,20.32 42.55,20.32 43.81,20.32 41.27,19.05 42.55,19.05 43.81,19.05 41.27,17.78 42.55,17.78 43.81,17.78
  pour Bottom (rank 6, no thermals): 0,52.07 1.27,53.34 96.52,53.34 99.06,50.8 99.06,40.64 101.6,38.1 101.6,3.81 99.06,1.27 99.06,0 1.27,0 0,1.27
  pour Top (rank 6, no thermals): 0,52.07 1.27,53.34 96.52,53.34 99.06,50.8 99.06,40.64 101.6,38.1 101.6,3.81 99.06,1.27 99.06,0 1.27,0 0,1.27
GPS_INT  (via drill 0.35 pad 0.1)
  Top 0.254: v66.67,32.38 66.64,32.35 GPS.16
  Bottom 0.254: U12.35 95.25,31.75 92.71,31.75 91.44,30.48 68.58,30.48 v66.67,32.38
GPS_WAKEUP
  Top 0.61: GPS.12 58.64,25.5 59.05,25.08 R38.1
INPUT  (via drill 0.35 pad 0.1)
  Top 0.61: 31.13,39.7 30.8,39.37 | C3.2 26.99,39.37 30.8,39.37 | U10.5 21.6,26.67 C23.2 | U13.3 30.8,39.7 30.8,39.37
  other vias: 21.91,38.73 20.32,21.27 20.32,20.32 21.91,37.78 20.64,38.73 20.64,37.78
  pour Top (no thermals): 28.08,37.18 28.08,41.25 20.9,41.25 20.9,40.01 10.84,40.01 10.84,45.57 9.02,45.57 9.02,40.31 9,40.31 9,37.18
  pour Top: 26.2,37.18 32.15,37.18 32.15,40.01 26.2,40.01
  pour Top (no thermals): 20.01,19.99 22.79,19.99 22.79,26.69 22.49,26.69 22.49,26.72 21.23,26.72 21.23,24.85 20,24.85 20,22.66 20.01,22.66
  pour Bottom (no thermals): 20,20 22.54,20 22.54,39.69 20,39.69
LED1  (via drill 0.35 pad 0.1)
  Top 0.305: LED4.A v78.42,29.21
  Bottom 0.305: v78.42,29.21 95.25,29.21 U12.37
LED2  (via drill 0.35 pad 0.1)
  Top 0.305: LED5.A v78.42,26.67
  Bottom 0.305: v78.42,26.67 95.25,26.67 U12.39
LED3  (via drill 0.35 pad 0.1)
  Top 0.305: LED6.A v78.42,24.13
  Bottom 0.305: v78.42,24.13 95.25,24.13 U12.41
LED4  (via drill 0.35 pad 0.1)
  Top 0.305: LED7.A v78.42,21.59
  Bottom 0.305: v78.42,21.59 95.25,21.59 U12.43
LED+
  pour Top (no thermals): 15.94,36.73 3.13,36.73 3.13,30.78 10.94,30.78 10.94,28.28 15.94,28.28
LED-  (via drill 0.35 pad 0.1)
  Top 0.406: U10.3 16.51,25.73 v16.25,25.47
  Top 0.813: R32.2 R31.2
  Bottom 0.406: v16.25,25.47 12.77,25.47 v12.7,25.71
  pour Top (no thermals): 3.17,30.16 10.48,30.16 10.48,27.62 13.33,27.62 13.33,23.5 8.25,23.5 8.25,25.08 3.17,25.08
LIGHT_PWM  (via drill 0.35 pad 0.1)
  Top 0.254: 20.31,25.64 20.31,24.53 v20.29,24.52
  Top 0.305: U10.4 20.31,25.64 | R30.2 v16.36,21.47 18.77,19.05 37.47,19.05 40.32,16.19 v49.53,16.19
  Bottom 0.305: v16.36,21.47 19.25,21.47 20.32,22.54 20.29,22.57 v20.29,24.52 | U12.45 95.25,19.05 52.39,19.05 v49.53,16.19
LUX
  Top 0.406: R27.1 91.07,11.7 U5.3 88.33,10.1 C15.1 88.93,9.49 U7.3 89.85,8.25 90.17,7.94 90.17,6.67 89.85,6.35 | 89.85,6.35 89.25,6.35 U7.1 | 89.85,6.35 91.44,4.76 U12.A15
MLDP
  Top 0.254: U3.6 18.09,12.06 13.97,7.94 12.06,7.94
  Top 0.305: 12.06,7.94 U2.P08
MLDP_ARD  (via drill 0.35 pad 0.1)
  Top 0.254: v40.64,11.75 40.33,12.06 U3.15
  Bottom 0.254: U12.52 92.71,10.16 91.44,11.43 40.96,11.43 v40.64,11.75
MLDPEV  (via drill 0.35 pad 0.1)
  Top 0.254: U2.P11 15.75,11.62 v16.51,12.38 17.48,13.36 U3.4 | R10.2 v7.3,4.45
  Bottom 0.254: v16.51,12.38 9.21,5.08 7.94,5.08 v7.3,4.45
MLDPEV_ARD  (via drill 0.35 pad 0.1)
  Top 0.254: v40.64,13.65 40.34,13.36 U3.17
  Bottom 0.254: U12.50 41.59,12.7 v40.64,13.65
N$1
  Top 0.61: R16.1 LED5.C
N$2
  Top 0.61: R15.1 LED4.C
N$3  (via drill 0.35 pad 0.1)
  Top 0.61: v33.34,38.1 R5.2 | U13.5 v33.34,40.64
  Bottom 0.61: v33.34,40.64 v33.34,38.1
N$4
  Top 0.61: C4.1 34.63,42.84 U13.6
N$5
  Top 0.813: R6.1 R7.2
N$6
  Top 0.61: U13.4 35.57,39.7 35.88,40.01 35.88,47.62 35.56,47.94 R8.2 R7.1
N$7
  Top 0.406: U5.6 85.04,13.7 R23.1
N$8
  Top 0.61: R17.1 LED6.C
N$9  (via drill 0.35 pad 0.1)
  Top 0.61: v130.18,19.68 130.18,17.14 137.79,17.14 137.79,24.77 128.91,24.77 128.91,15.88 139.06,15.88 139.06,26.04 127.63,26.04 127.63,14.61 140.34,14.61 140.34,27.3 126.37,27.3 126.37,13.34 141.61,13.34 141.61,28.57 125.09,28.57 125.09,12.06 142.88,12.06 142.88,29.84 123.82,29.84 123.82,10.79 144.15,10.79 144.15,31.11 122.56,31.11 122.56,9.53 145.42,9.53 145.42,32.38 121.28,32.38 121.28,8.26 146.69,8.26 146.69,33.66 120.01,33.66 120.01,6.99 147.96,6.99 147.96,34.92 118.75,34.92 118.75,5.71 149.22,5.71 149.22,36.2 117.47,36.2 117.47,21.95 C12.1 115.62,22.23 113.35,22.23 112.71,21.59 NFC.3 | v117.16,19.68 116.89,19.95 C12.2 115.62,19.68 113.35,19.68 112.71,20.32 NFC.2
  Bottom 0.61: v130.18,19.68 v117.16,19.68
N$10
  Top 0.61: Q3.3 70.8,17.46 69.85,16.51 69.85,14.93 R22.1 R21.2
N$11
  Top 0.61: R13.1 110.81,17.14 111.5,17.84 NFC.1
N$12
  Top 0.406: NFC.7 R14.1
  Top 0.61: R14.1
N$13
  Top 0.61: R20.1 R19.2 Q3.1
N$14
  Top 0.61: U6.A 73.66,11.43 72.71,12.38 R21.1
N$15
  Top 0.61: U6.C 73.66,8.89 72.71,7.94 R25.1
N$16
  Top 0.61: R9.1 13.87,1.27 LED1.A
N$17
  Top 0.61: R10.1 9.43,1.27 LED2.A
N$18
  Top 0.61: R11.1 4.98,1.27 LED3.A
N$19
  Top 0.406: U10.6 20.32,27.61 | C26.2 20.32,30.48
  pour Top (rank 2, no thermals): 19.07,31.75 19.07,27.66 24.09,27.66 24.09,36.75 16.84,36.75 16.84,31.75
N$20  (via drill 0.35 pad 0.1)
  Top 0.406: v17.78,28.9 17.78,30.48 C26.1
  Top 0.61: D1.C 17.78,22.86 v17.78,24.13 | U10.1 17.78,27.61 v17.78,28.9
  Bottom 0.61: v17.78,24.13 v17.78,28.9
N$21
  Top 0.61: R18.1 LED7.C
N$22
  Top 0.61: U8.C 49.76,10.71 R29.1
N$23
  Top 0.254: U11.2 89.23,46.34 89.53,46.04 89.53,43.5 89.22,43.18 Y1.P$1
N$24
  Top 0.254: Y1.P$2 84.46,44.13 86.04,45.72 88.16,45.72 U11.1
N$25
  Top 0.254: IC1.6 53.17,46.82 C18.1
N$26  (via drill 0.35 pad 0.1)
  Top 0.254: C29.1 v62.23,16.62
  Bottom 0.254: v62.23,16.62 61.81,17.03 MIC.OUT
N$27
  Top 0.254: R33.2 C29.2 60.33,17.15 59.05,15.88 59.05,14.29 58.74,13.97 57.7,13.97 IC2.1
N$28
  Top 0.254: R34.2 C30.1 R35.1 57.68,17.36 IC2.3
N$29
  Top 0.254: C31.1 53.64,15.26 IC2.4 55.88,15.36 R35.2 C30.2
N$30
  Top 0.254: R37.2 R36.2 C31.2
N$34
  Top 0.61: C37.2 C38.2 46.99,23.39 L3.2 47.09,23.91 48.58,25.4 48.69,25.4 GPS.7
N$35
  Top 1.016: JP1.SIGNAL 43.83,33.55 GPS.2
N$36
  Top 0.254: U9.2 73.67,36.19 C22.2
NO2
  Top 0.61: U6.D 73.66,6.71 72.66,5.71 | R26.1 72.66,5.71 | U12.A8 73.66,4.72 72.66,5.71
RX3_ARD  (via drill 0.35 pad 0.1)
  Top 0.305: U3.12 39.63,10.11 v39.69,10.16
  Bottom 0.305: U12.15 71.12,49.85 67.63,46.35 57.47,46.35 39.69,28.57 v39.69,10.16
RX_BLE
  Top 0.254: U3.8 18.7,10.76 13.97,6.03 10.48,6.03 9.65,6.86 U2.P06
SCL_3V3  (via drill 0.35 pad 0.1)
  Top 0.254: Q2.2 v74.93,41.59 R3.2 | GPS.14 62.12,29.95 62.87,29.21 66.99,29.21
  Top 0.305: IC1.2 58.03,47.55 58.42,47.94 65.09,47.94 68.26,44.77 68.26,41.59 | 66.99,29.21 68.26,30.48 68.26,33.66 | U4.SCK 65.45,38.37 v65.09,38.1 | 68.26,41.59 68.26,33.66 | R3.2 69.22,41.59 68.26,41.59 | v65.09,34.92 66.36,33.66 68.26,33.66 | U9.8 80.3,37.44 v80.33,37.47 79.02,37.47 U9.8
  Top 0.61: NFC.6 v100.33,21.59
  Bottom 0.254: v100.33,21.59 100.97,22.23 100.97,33.66 97.79,36.83 80.96,36.83 v80.33,37.47 79.38,37.47 v74.93,41.59
  Bottom 0.305: v65.09,38.1 v65.09,34.92
SCL_5V
  Top 0.254: U12.21 86.36,48.26 85.09,46.99 83.92,46.99 | 83.92,46.99 U11.6 | 83.92,46.99 82.55,46.99 82.23,46.67 80.01,46.67 79.69,46.35 79.69,43.81 80.01,43.5 | 80.01,43.5 R4.2 | Q2.3 79.06,42.55 80.01,43.5
SDA_3V3  (via drill 0.35 pad 0.1)
  Top 0.254: R1.2 73.66,45.72 v74.93,45.72 Q1.2 | GPS.13 61.42,28.75 62.23,27.94 62.23,27.3 62.87,26.67 67.31,26.67 68.9,28.26 v68.9,34.61 | U9.7 80.32,36.19 v80.33,36.2
  Top 0.305: v80.33,36.2 U9.7 | IC1.3 57.23,47.71 58.1,48.58 65.41,48.58 68.26,45.72 R1.2 | U4.DATA 65.45,42.81 v64.77,43.5
  Top 0.61: v100.33,22.86 NFC.5
  Bottom 0.254: v100.33,22.86 100.33,31.75 97.79,34.29 82.23,34.29 v80.33,36.2 | v68.9,34.61 68.9,38.73 72.71,42.55 | 72.71,42.55 74.93,44.77 v74.93,45.72 | 79.69,36.2 72.71,42.55
  Bottom 0.305: 79.69,36.2 v80.33,36.2 | v64.77,43.5 64.77,44.77 65.72,45.72 v74.93,45.72
SDA_5V
  Top 0.254: Q1.3 79.2,47.62 R2.2 82.23,47.62 82.54,47.64 U11.5 83.82,47.73 U12.20
SW  (via drill 0.35 pad 0.1)
  Top 0.61: C4.2 v30.8,43.18 | U13.2 29.67,40.64 v29.67,40.62
  Bottom 0.61: v30.8,43.18 30.8,41.46 30.59,41.25 30.59,40.85 30.48,40.95
  other vias: 28.71,41.56 29.65,41.56 28.71,40.62 12.45,42.19 12.45,41.25
  pour Bottom (no thermals): 12.09,41.56 32.15,41.56 32.15,40.62 12.09,40.62
  pour Top (no thermals): 28.71,41.56 28.71,40.62 29.65,40.62 29.65,41.56
  pour Bottom (no thermals): 11.82,40.62 11.82,42.81 13.38,42.81 13.38,40.62
  pour Top (no thermals): 11.5,45.63 11.5,40.62 13.07,40.62 13.07,45.63
SW1
  Top 0.254: 89.53,39.05 93.03,35.56
  Top 0.406: S1.2 89.53,39.05 | 93.03,35.56 U12.32
SW2
  Top 0.406: U12.34 91.3,33.02 S2.2
TX3_ARD  (via drill 0.35 pad 0.1)
  Top 0.305: U3.13 39.09,10.76 v39.05,10.79
  Bottom 0.305: U12.14 68.58,48.9 66.67,46.99 57.15,46.99 39.05,28.89 v39.05,10.79
TX_BLE
  Top 0.254: U3.9 19,10.11 14.29,5.4 9.84,5.4 8.45,6.79 U2.P05
WAKEHW
  Top 0.254: U2.P15 16.6,16.42 17.71,15.31 U3.1
WAKEHW_ARD  (via drill 0.35 pad 0.1)
  Top 0.254: U3.20 40.39,15.31 v40.64,15.56
  Bottom 0.254: 91.44,13.97 42.23,13.97 v40.64,15.56
  Bottom 0.305: U12.48 92.71,15.24 91.44,13.97
WAKESW
  Top 0.254: U3.7 18.39,11.41 13.65,6.67 11.11,6.67 10.85,6.93 U2.P07
WAKESW_ARD  (via drill 0.35 pad 0.1)
  Top 0.254: v40.64,10.79 40.03,11.41 U3.14
  Bottom 0.254: 91.12,10.79 v40.64,10.79
  Bottom 0.305: U12.53 95.25,8.89 93.03,8.89 91.12,10.79

### Text on the board
tNames: STIJN CRUL
bNames: STIJN CRUL